# EAGLE board controller-ha-v2 (EAGLE 6.5.0), part 1 of 2
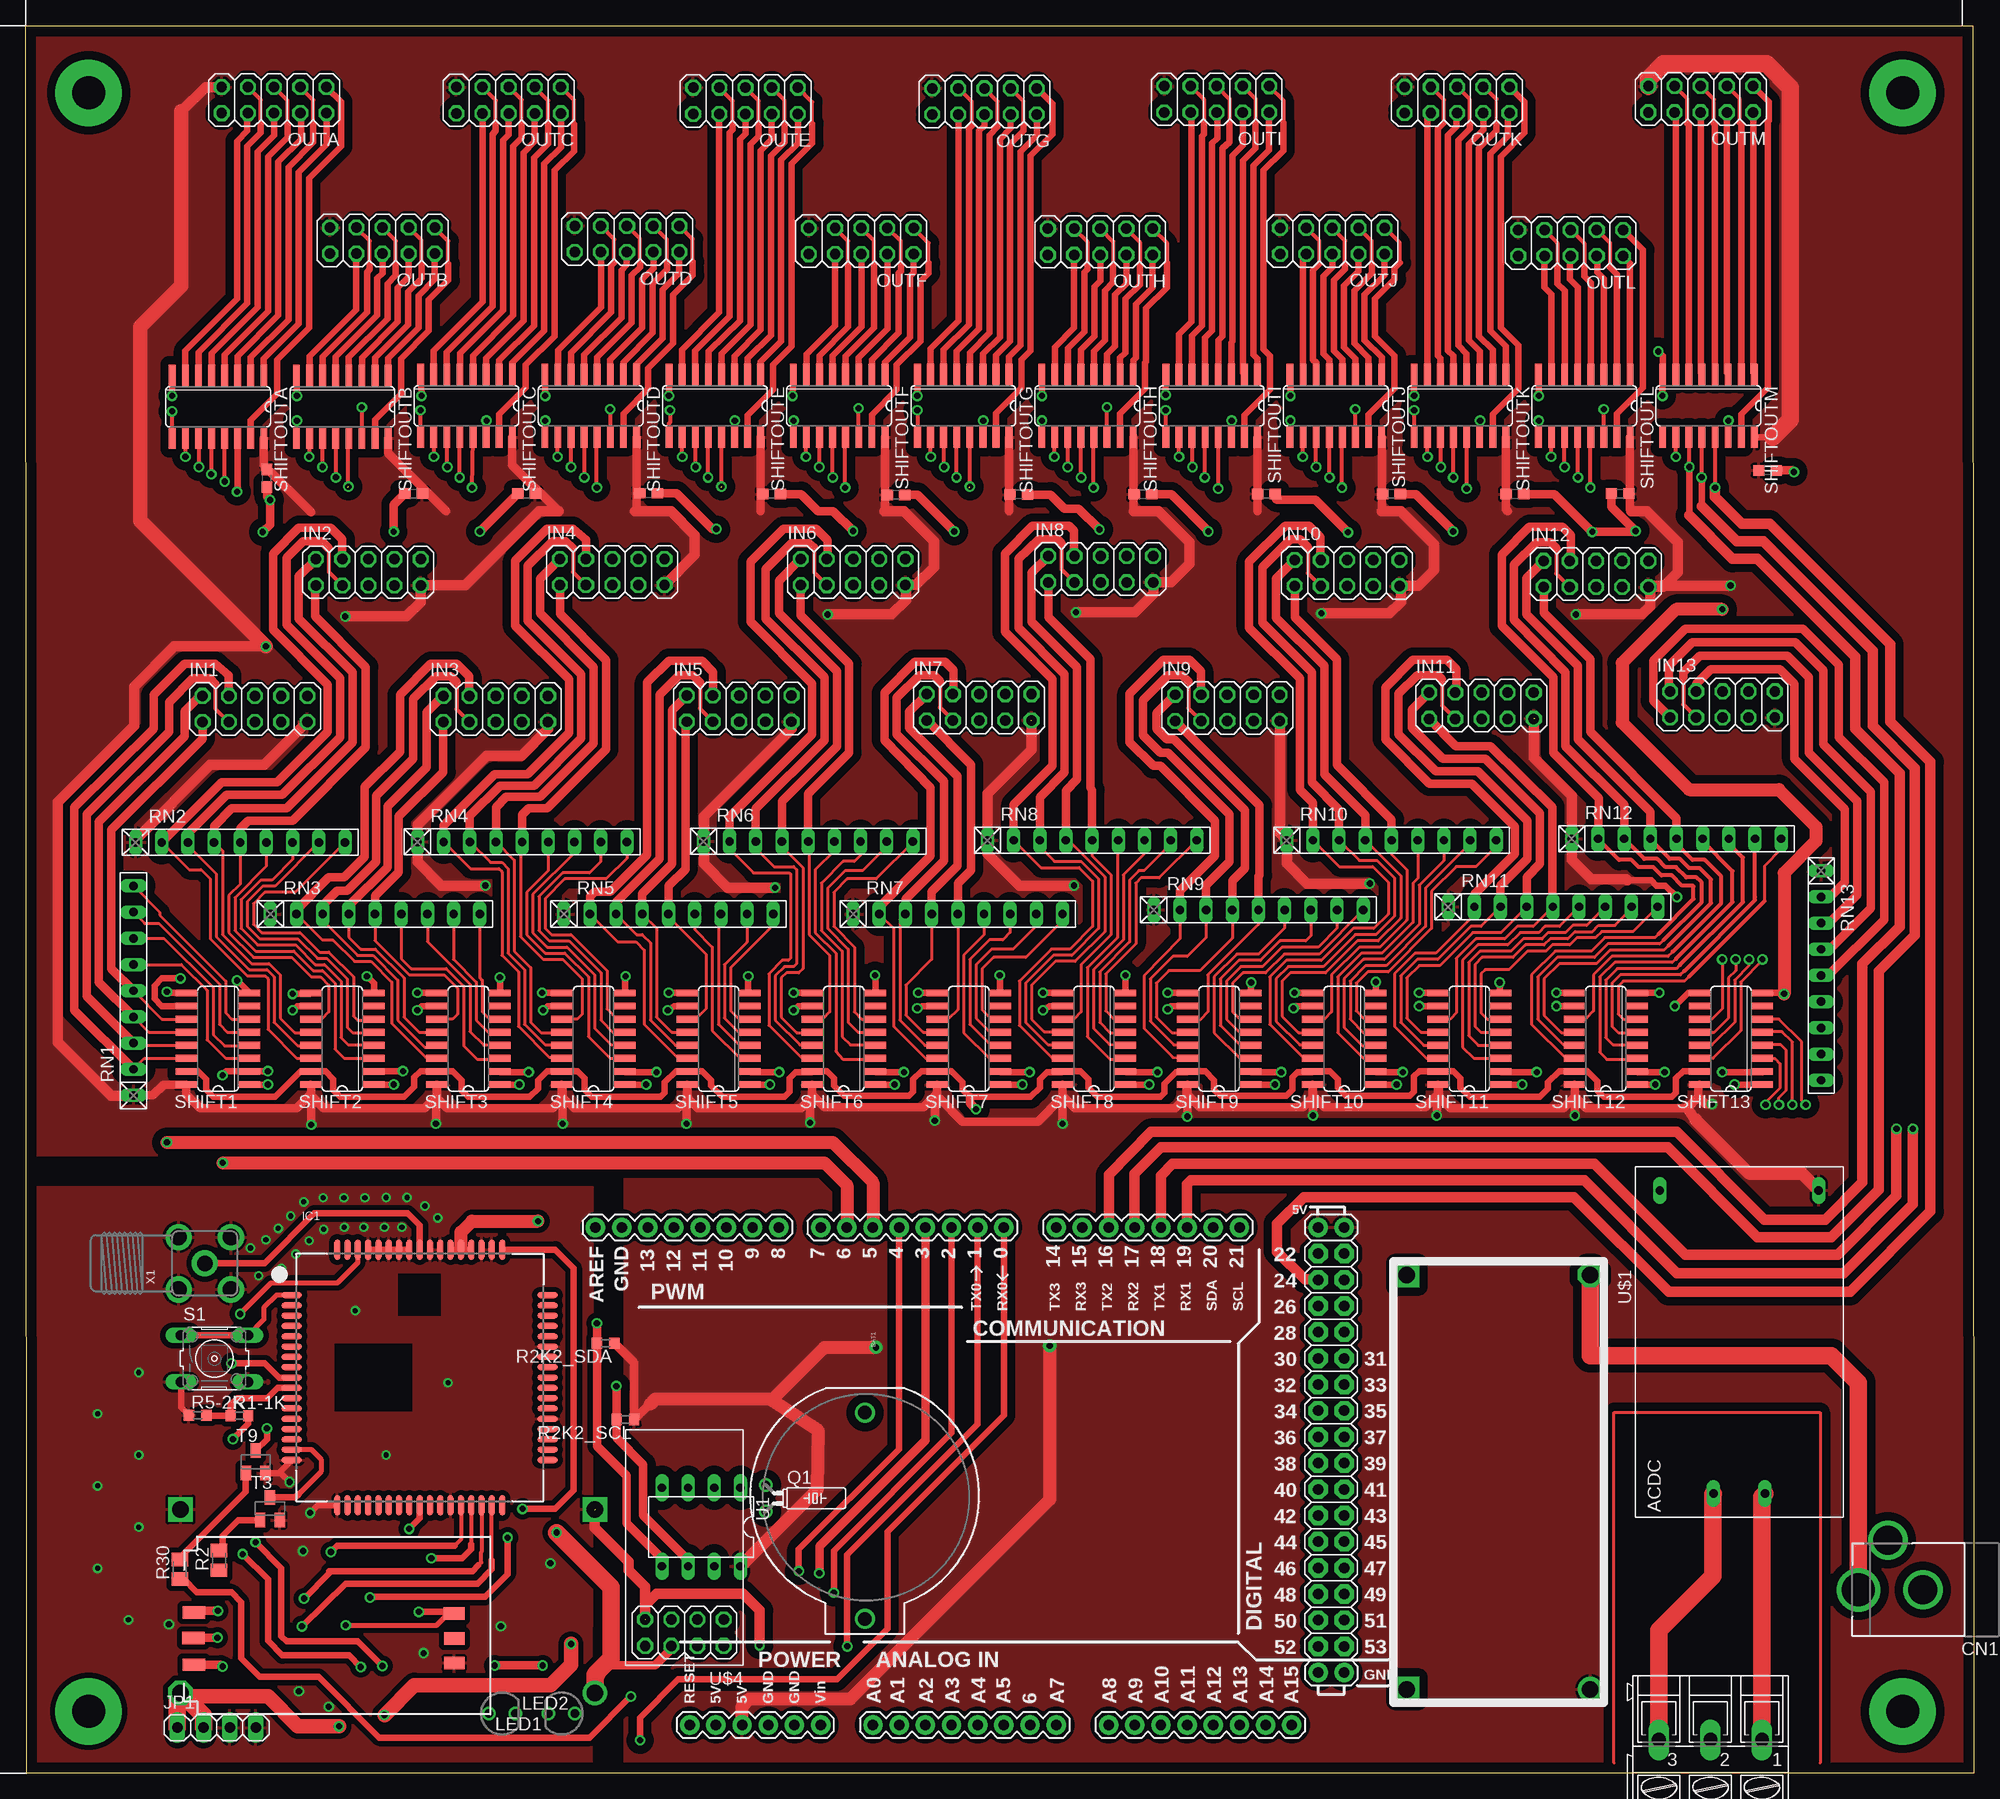
[diagram p2: board, top side]
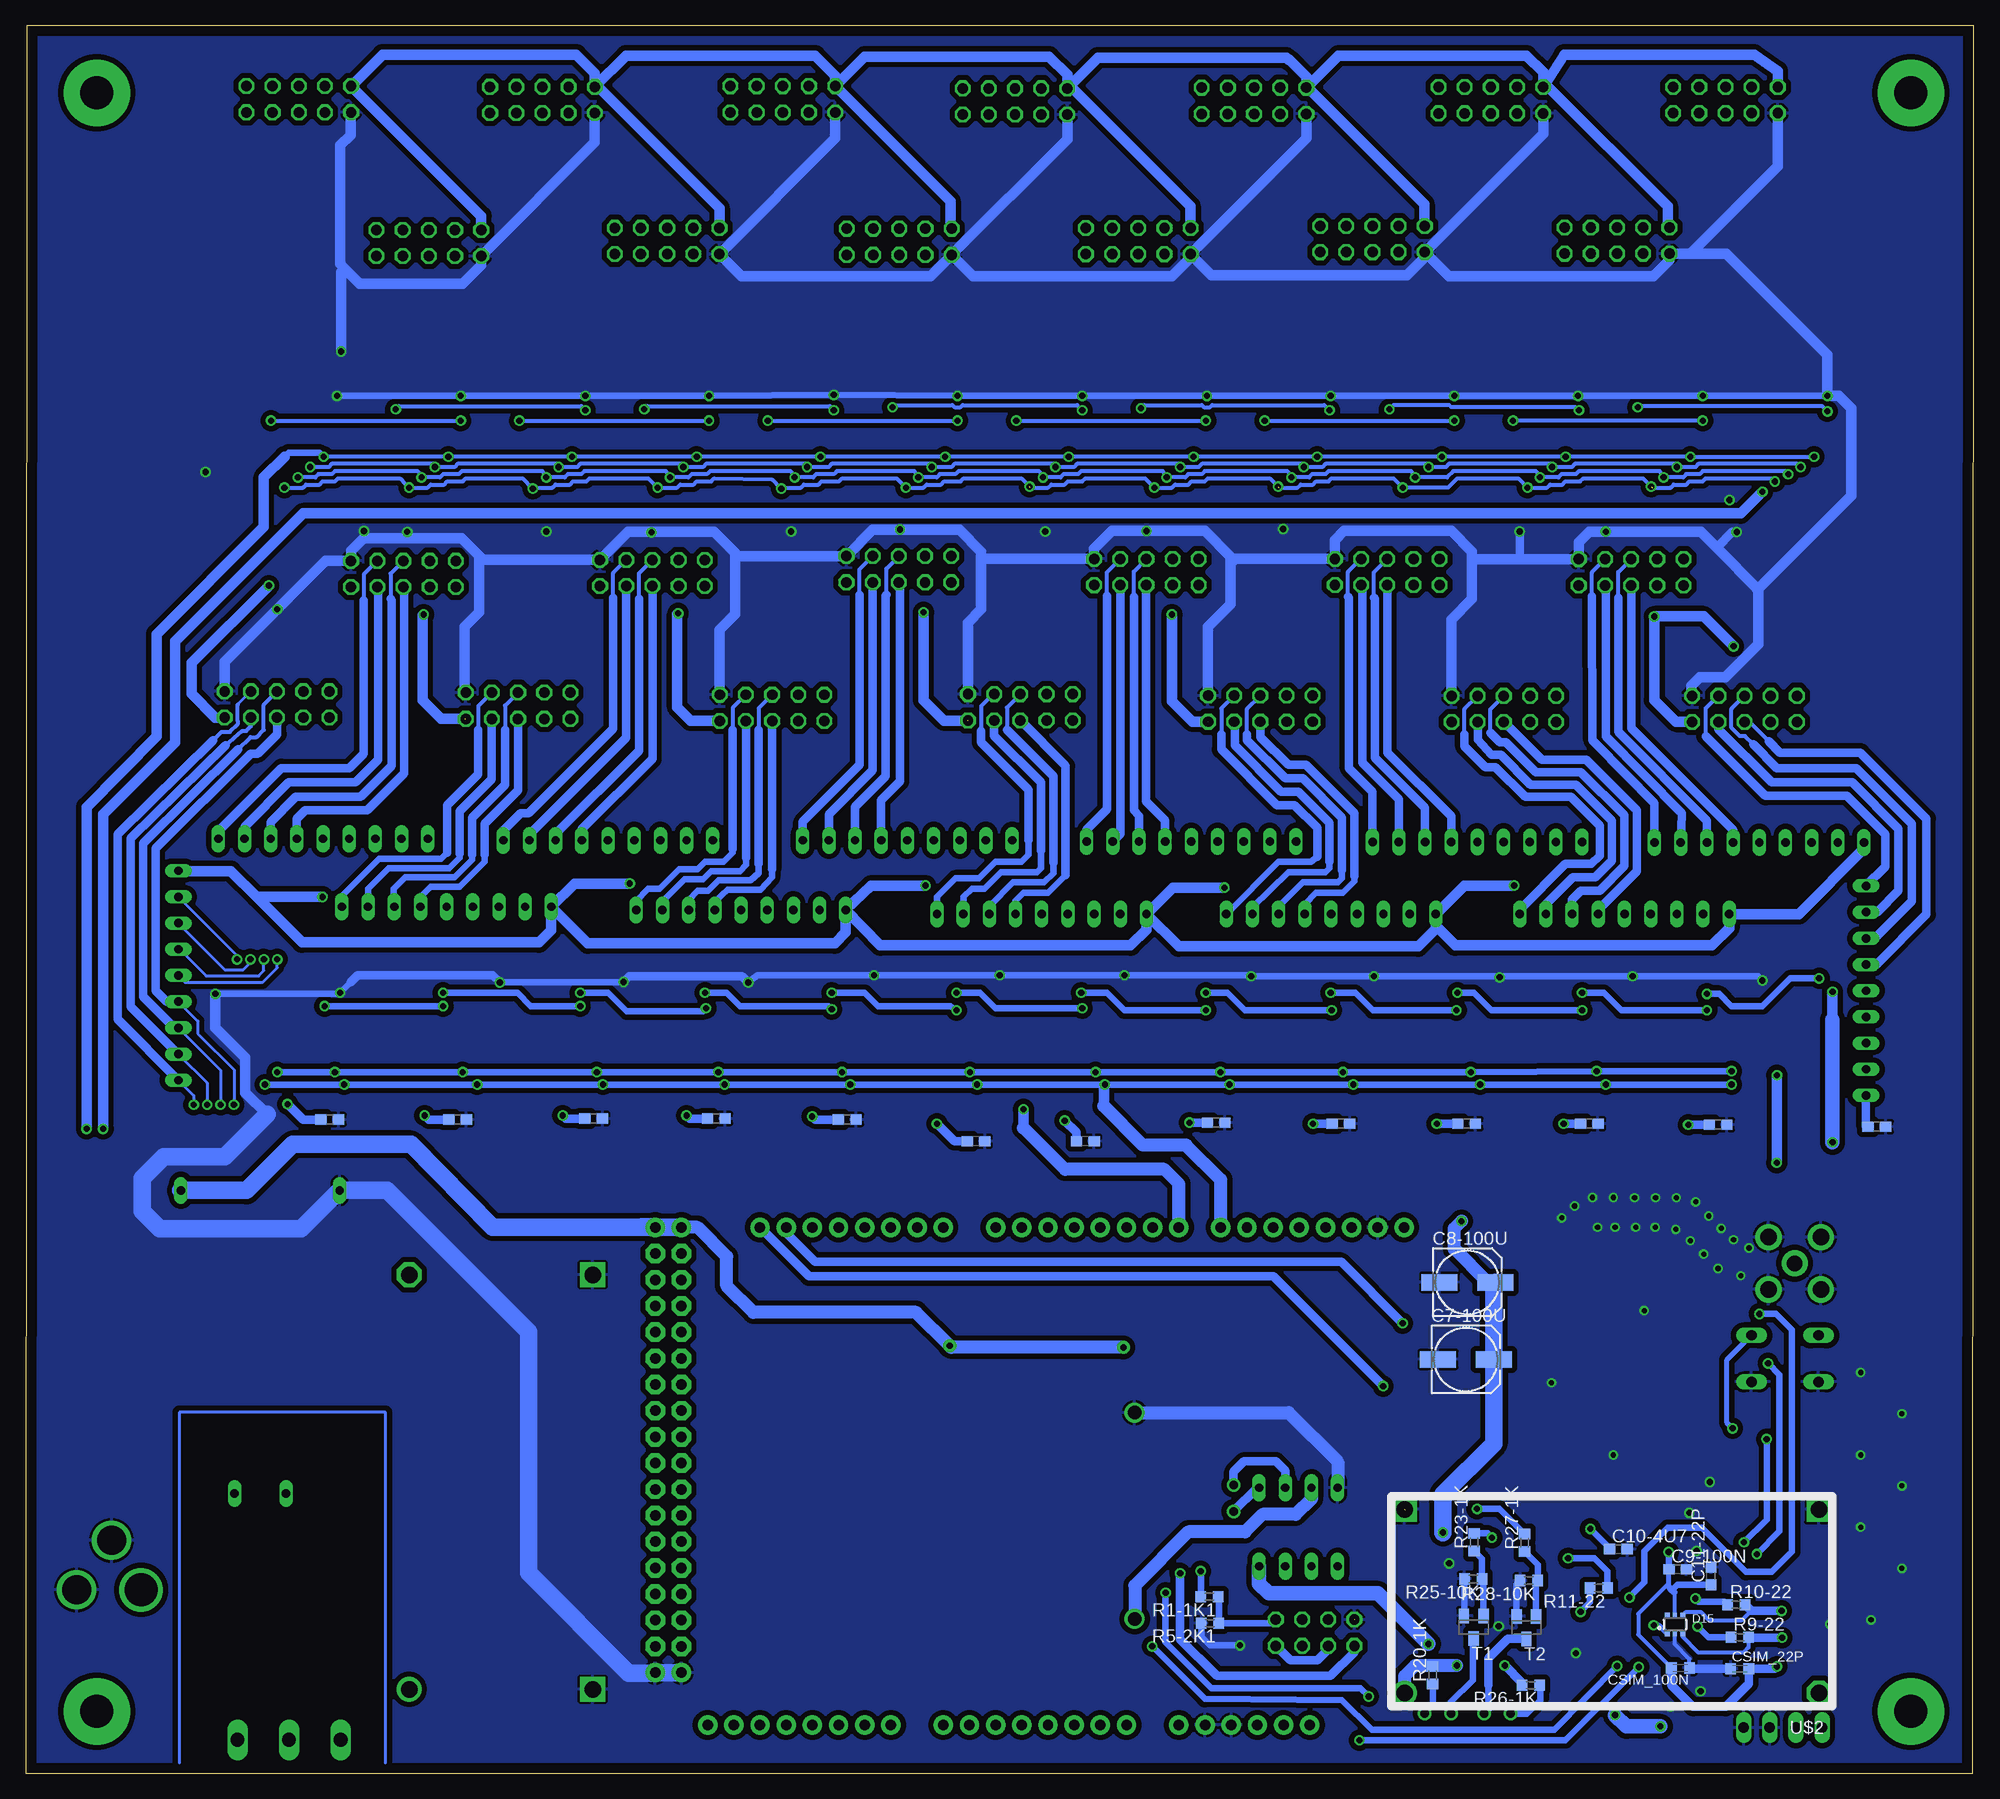
[diagram p3: board, bottom side, seen from below]

Size 189 x 169.5 mm. Coordinates in mm from the lower left corner, seen from the top.
Outline: 0.1,0 0,169.5 188.9,169.5 189,0 0.1,0
Copper layers (1*16): Top 0.035mm / dielectric 1.5mm / Bottom 0.035mm
Design rules "default": minimum track width 10mil, minimum drill 24mil, track to track 8mil, track to pad 8mil, pad to pad 8mil, via to via 8mil, smd to smd 8mil, copper to edge 40mil, drill to drill 8mil, minimum pad ring 10mil, minimum via ring 8mil, stop-mask expansion 4mil, vias tented up to drill 0mil, thermal gap 10mil
Net classes: 1 power: width 0.305 mm, drill 0.6 mm, clearance 0.813 mm; 2 GND: width 0.305 mm, drill 0.6 mm, clearance 0.508 mm; 3 LIVEAC: width 0.508 mm, drill 0.508 mm, clearance 1.27 mm

## Footprints (pad centres in the part's own frame; a part is rotated, then mirrored left to right if it is on the bottom)
AK3003 = drill 1.321 long: 1 -5.004,0; 2 0,0; 3 5.004,0
HLK-PM01 = drill 0.8 long: AC$1 -14.7,2.5; AC$2 -14.7,-2.5; GND 14.7,7.7; VOUT 14.7,-7.7
BATTCOM_20MM_PTH = drill 1.3: 1 11.85,0; 2 -8.15,0
153CLV-0605 = smd 3.5 x 1.6: + 2.7,0; - -2.7,0
C0603 = smd 1.1 x 1: 1 -0.85,0; 2 0.85,0
DCJACK_2MM_PTH = drill 2.8: GND 0,7.35; GNDBREAK 4.8,10.75 | drill 3.2: PWR 0,13.6
C0603K = smd 1.05 x 1.08: 1 -0.875,0; 2 0.875,0
SOT363 = smd 0.5 x 0.5: 1 -0.75,-0.9; 3 0.75,-0.9; 4 0.75,0.9; 6 -0.75,0.9 | smd 0.4 x 0.5: 2 0,-0.9; 5 0,0.9
SIM900_SMT = smd 2 x 0.6: P$1 -12.4,8; P$2 -12.4,7; P$3 -12.4,6; P$4 -12.4,5; P$5 -12.4,4; P$6 -12.4,3; P$7 -12.4,2; P$8 -12.4,1; P$9 -12.4,0; P$10 -12.4,-1; P$11 -12.4,-2; P$12 -12.4,-3; P$13 -12.4,-4; P$14 -12.4,-5; P$15 -12.4,-6; P$16 -12.4,-7; P$17 -12.4,-8; P$35 12.4,-8; P$36 12.4,-7; P$37 12.4,-6; P$38 12.4,-5; P$39 12.4,-4; P$40 12.4,-3; P$41 12.4,-2; P$42 12.4,-1; P$43 12.4,0; P$44 12.4,1; P$45 12.4,2; P$46 12.4,3; P$47 12.4,4; P$48 12.4,5; P$49 12.4,6; P$50 12.4,7; P$51 12.4,8 | smd 0.6 x 2: P$18 -8,-12.4; P$19 -7,-12.4; P$20 -6,-12.4; P$21 -5,-12.4; P$22 -4,-12.4; P$23 -3,-12.4; P$24 -2,-12.4; P$25 -1,-12.4; P$26 0,-12.4; P$27 1,-12.4; P$28 2,-12.4; P$29 3,-12.4; P$30 4,-12.4; P$31 5,-12.4; P$32 6,-12.4; P$33 7,-12.4; P$34 8,-12.4; P$52 8,12.4; P$53 7,12.4; P$54 6,12.4; P$55 5,12.4; P$56 4,12.4; P$57 3,12.4; P$58 2,12.4; P$59 1,12.4; P$60 0,12.4; P$61 -1,12.4; P$62 -2,12.4; P$63 -3,12.4; P$64 -4,12.4; P$65 -5,12.4; P$66 -6,12.4; P$67 -7,12.4; P$68 -8,12.4
2X05 = drill 1.016 octagon: 1 -5.08,-1.27; 2 -5.08,1.27; 3 -2.54,-1.27; 4 -2.54,1.27; 5 0,-1.27; 6 0,1.27; 7 2.54,-1.27; 8 2.54,1.27; 9 5.08,-1.27; 10 5.08,1.27
1X04 = drill 1.016 long: 1 -3.81,0; 2 -1.27,0; 3 1.27,0; 4 3.81,0
LED3MM-NS = drill 0.813: A -1.27,0; K 1.27,0
TC26H = drill 0.813: 1 -1.27,0; 2 1.27,0
R0603 = smd 1 x 1.1: 1 -0.85,0; 2 0.85,0
M0805 = smd 1.3 x 1.6: 1 -0.95,0; 2 0.95,0
RN-9 = drill 0.813 long: 1 -10.16,0; 2 -7.62,0; 3 -5.08,0; 4 -2.54,0; 5 0,0; 6 2.54,0; 7 5.08,0; 8 7.62,0; 9 10.16,0
B3F-10XX = drill 1.016 long: 1 -3.251,2.261; 2 3.251,2.261; 3 -3.251,-2.261; 4 3.251,-2.261
SO16 = smd 0.66 x 2.032: 1 -4.445,-3.073; 2 -3.175,-3.073; 3 -1.905,-3.073; 4 -0.635,-3.073; 5 0.635,-3.073; 6 1.905,-3.073; 7 3.175,-3.073; 8 4.445,-3.073; 9 4.445,3.073; 10 3.175,3.073; 11 1.905,3.073; 12 0.635,3.073; 13 -0.635,3.073; 14 -1.905,3.073; 15 -3.175,3.073; 16 -4.445,3.073
SOT23-BEC = smd 1 x 1.4: B -0.95,-1.1; C 0,1.1; E 0.95,-1.1
DIL08 = drill 0.813 long: 1 -3.81,-3.81; 2 -1.27,-3.81; 3 1.27,-3.81; 4 3.81,-3.81; 5 3.81,3.81; 6 1.27,3.81; 7 -1.27,3.81; 8 -3.81,3.81
ARDUINO_MEGA = drill 1.016 pad 1.88: 0 63.5,50.8; 1 60.96,50.8; 2 58.42,50.8; 3 55.88,50.8; 3.3V 35.56,2.54; 4 53.34,50.8; 5 50.8,50.8; 5V@0 38.1,2.54; 5V@1 93.98,50.8; 5V@2 96.52,50.8; 6 48.26,50.8; 7 45.72,50.8; 8 41.656,50.8; 9 39.116,50.8; 10 36.576,50.8; 11 34.036,50.8; 12 31.496,50.8; 13 28.956,50.8; 14 68.58,50.8; 15 71.12,50.8; 16 73.66,50.8; 17 76.2,50.8; 18 78.74,50.8; 19 81.28,50.8; 20 83.82,50.8; 21 86.36,50.8; A0 50.8,2.54; A1 53.34,2.54; A2 55.88,2.54; A3 58.42,2.54; A4 60.96,2.54; A5 63.5,2.54; A6 66.04,2.54; A7 68.58,2.54; A8 73.66,2.54; A9 76.2,2.54; A10 78.74,2.54; A11 81.28,2.54; A12 83.82,2.54; A13 86.36,2.54; A14 88.9,2.54; A15 91.44,2.54; AREF 23.876,50.8; GND@0 40.64,2.54; GND@1 43.18,2.54; GND@2 93.98,7.62; GND@3 96.52,7.62; GND@4 26.416,50.8; RESET 33.02,2.54; VIN 45.72,2.54 | drill 1.016 pad 1.88 octagon: 22 93.98,48.26; 23 96.52,48.26; 24 93.98,45.72; 25 96.52,45.72; 26 93.98,43.18; 27 96.52,43.18; 28 93.98,40.64; 29 96.52,40.64; 30 93.98,38.1; 31 96.52,38.1; 32 93.98,35.56; 33 96.52,35.56; 34 93.98,33.02; 35 96.52,33.02; 36 93.98,30.48; 37 96.52,30.48; 38 93.98,27.94; 39 96.52,27.94; 40 93.98,25.4; 41 96.52,25.4; 42 93.98,22.86; 43 96.52,22.86; 44 93.98,20.32; 45 96.52,20.32; 46 93.98,17.78; 47 96.52,17.78; 48 93.98,15.24; 49 96.52,15.24; 50 93.98,12.7; 51 96.52,12.7; 52 93.98,10.16; 53 96.52,10.16
DCDCMODULE = drill 1.6 square: GND#0 1.7,1.7; GND#1 41.9,1.7 | drill 1.6 octagon: VIN 1.7,19.5 | drill 1.6: VOUT 41.9,19.5
ESP8266 = drill 1.016 octagon: CHPD 1.27,1.27; GND 3.81,-1.27; IO0 -1.27,-1.27; IO2 1.27,-1.27; RST -1.27,1.27; RXD -3.81,-1.27; TXD 3.81,1.27; VCC -3.81,1.27
SIMHOLDER3 = smd 2.2 x 1.2: 1 0.95,4.81; 2 0.91,7.41; 3 0.95,9.86 | smd 2 x 1.2: 4 26.2,9.78; 5 26.22,7.34; 6 26.22,4.98
SMA90_DIP = drill 1.5 pad 2.54: ANTENNA 0,0 | drill 1.6 pad 2.54: GND1 -2.54,2.54; GND2 2.54,2.54; GND3 -2.54,-2.54; GND4 2.54,-2.54

## Placement (x,y rotation side)
AC_IN  AK3003  [AK3003]  163.45,3.24 180 top
ACDC  HLK-PM01  [HLK-PM01]  166.25,41.83 90 top
BAT1  [BATTCOM_20MM_PTH]  81.42,26.82 270 top
C7-100U  [153CLV-0605]  49.27,40.14 0 bottom
C8-100U  [153CLV-0605]  49.13,47.62 0 bottom
C9-100N  [C0603]  28.72,19.79 0 bottom
C9-100N1  [C0603]  9.4,62.7 180 bottom
C9-100N2  [C0603]  24.8,62.9 180 bottom
C9-100N3  [C0603]  37.3,63 180 bottom
C9-100N4  [C0603]  49.2,63 180 bottom
C9-100N5  [C0603]  61.4,63 180 bottom
C9-100N6  [C0603]  73.5,63.1 180 bottom
C9-100N7  [C0603]  86.2,61.3 180 bottom
C9-100N8  [C0603]  96.8,61.3 180 bottom
C9-100N9  [C0603]  109.3,63.4 180 bottom
C9-100N10  [C0603]  122,63.5 180 bottom
C9-100N11  [C0603]  133.9,63.5 180 bottom
C9-100N12  [C0603]  147.1,63.4 180 bottom
C9-100N13  [C0603]  159.5,63.4 180 bottom
C9-100N14  [C0603]  23.4,125.6 90 top
C9-100N15  [C0603]  37.62,124.13 0 top
C9-100N16  [C0603]  48.59,124.13 0 top
C9-100N17  [C0603]  60.42,124.15 180 top
C9-100N18  [C0603]  72.36,124.08 180 top
C9-100N19  [C0603]  84.44,124 180 top
C9-100N20  [C0603]  96.34,124.03 180 top
C9-100N21  [C0603]  108.4,124.05 180 top
C9-100N22  [C0603]  120.38,124.09 180 top
C9-100N23  [C0603]  132.49,124.08 180 top
C9-100N24  [C0603]  144.49,124.07 180 top
C9-100N25  [C0603]  154.69,124.12 0 top
C9-100N26  [C0603]  169,126.37 180 top
C10-4U7  [C0603]  34.48,21.74 0 bottom
C11-22P  [C0603]  25.48,19.13 90 bottom
CN1  [DCJACK_2MM_PTH]  191.42,17.79 90 top
CSIM_22P  [C0603K]  22.71,10.14 0 bottom
CSIM_100N  [C0603K]  28.45,10.21 180 bottom
D15  [SOT363]  28.99,14.43 0 bottom
IC1  [SIM900_SMT]  38.22,38.38 0 top
IN1  [2X05]  22.24,103.24 0 top
IN2  [2X05]  33.24,116.49 0 top
IN3  [2X05]  45.59,103.24 0 top
IN4  [2X05]  56.9,116.52 0 top
IN5  [2X05]  69.21,103.26 0 top
IN6  [2X05]  80.27,116.51 0 top
IN7  [2X05]  92.5,103.39 0 top
IN8  [2X05]  104.29,116.79 0 top
IN9  [2X05]  116.59,103.34 0 top
IN10  [2X05]  128.2,116.42 0 top
IN11  [2X05]  141.24,103.55 0 top
IN12  [2X05]  152.35,116.33 0 top
IN13  [2X05]  164.62,103.67 0 top
JP1  [1X04]  18.52,4.42 0 top
LED1  [LED3MM-NS]  51.99,5.8 180 top
LED2  [LED3MM-NS]  46.22,5.78 0 top
OUTA  [2X05]  24.09,162.29 180 top
OUTB  [2X05]  34.61,148.66 180 top
OUTC  [2X05]  46.85,162.28 180 top
OUTD  [2X05]  58.34,148.81 180 top
OUTE  [2X05]  69.83,162.22 180 top
OUTF  [2X05]  81.06,148.61 180 top
OUTG  [2X05]  93.02,162.16 180 top
OUTH  [2X05]  104.25,148.55 180 top
OUTI  [2X05]  115.55,162.37 180 top
OUTJ  [2X05]  126.77,148.63 180 top
OUTK  [2X05]  138.87,162.31 180 top
OUTL  [2X05]  149.89,148.43 180 top
OUTM  [2X05]  162.51,162.38 180 top
Q1  [TC26H]  71.81,26.67 270 top
R1-1K  [R0603]  20.73,34.68 0 top
R1-1K1  [R0603]  74.15,17.11 180 bottom
R2  R120  [M0805]  18.76,20.64 90 top
R2K2_SCL  [R0603]  58.17,34.31 180 top
R2K2_SDA  [R0603]  56.26,41.71 180 top
R5-2K  [R0603]  16.68,34.72 0 top
R5-2K1  [R0603]  74.1,14.54 0 bottom
R9-22  [R0603]  22.69,13.19 0 bottom
R10-22  [R0603]  23.03,16.34 0 bottom
R11-22  [R0603]  36.38,17.96 180 bottom
R20-1K  [R0603]  52.49,9.5 90 bottom
R23-1K  [R0603]  48.47,22.41 90 bottom
R25-10K  [R0603]  48.56,18.84 180 bottom
R26-1K  [R0603]  42.97,8.53 180 bottom
R27-1K  [R0603]  43.56,22.34 90 bottom
R28-10K  [R0603]  43.16,18.68 180 bottom
R30  R120  [M0805]  14.95,19.79 90 top
RN1  [RN-9]  10.45,75.9 90 top
RN2  [RN-9]  20.81,90.29 0 top
RN3  [RN-9]  33.89,83.34 0 top
RN4  [RN-9]  48.16,90.34 0 top
RN5  [RN-9]  62.36,83.34 0 top
RN6  [RN-9]  75.91,90.39 0 top
RN7  [RN-9]  90.43,83.34 0 top
RN8  [RN-9]  103.46,90.49 0 top
RN9  [RN-9]  119.6,83.74 0 top
RN10  [RN-9]  132.51,90.49 0 top
RN11  [RN-9]  148.17,84.04 0 top
RN12  [RN-9]  160.16,90.64 0 top
RN13  [RN-9]  174.2,77.38 270 top
S1  [B3F-10XX]  18.31,40.22 0 top
SHIFT1  74HC165D  [SO16]  18.66,71.24 90 top
SHIFT2  74HC165D  [SO16]  30.71,71.24 90 top
SHIFT3  74HC165D  [SO16]  42.94,71.24 90 top
SHIFT4  74HC165D  [SO16]  55.08,71.24 90 top
SHIFT5  74HC165D  [SO16]  67.22,71.24 90 top
SHIFT6  74HC165D  [SO16]  79.36,71.24 90 top
SHIFT7  74HC165D  [SO16]  91.5,71.24 90 top
SHIFT8  74HC165D  [SO16]  103.64,71.24 90 top
SHIFT9  74HC165D  [SO16]  115.78,71.24 90 top
SHIFT10  74HC165D  [SO16]  127.92,71.24 90 top
SHIFT11  74HC165D  [SO16]  140.06,71.24 90 top
SHIFT12  74HC165D  [SO16]  153.3,71.24 90 top
SHIFT13  74HC165D  [SO16]  165.44,71.24 90 top
SHIFTOUTA  74HC595D  [SO16]  18.66,132.54 180 top
SHIFTOUTB  74HC595D  [SO16]  30.71,132.54 180 top
SHIFTOUTC  74HC595D  [SO16]  42.76,132.64 180 top
SHIFTOUTD  74HC595D  [SO16]  54.81,132.64 180 top
SHIFTOUTE  74HC595D  [SO16]  66.86,132.64 180 top
SHIFTOUTF  74HC595D  [SO16]  78.91,132.64 180 top
SHIFTOUTG  74HC595D  [SO16]  90.96,132.64 180 top
SHIFTOUTH  74HC595D  [SO16]  103.01,132.64 180 top
SHIFTOUTI  74HC595D  [SO16]  115.06,132.64 180 top
SHIFTOUTJ  74HC595D  [SO16]  127.11,132.64 180 top
SHIFTOUTK  74HC595D  [SO16]  139.16,132.64 180 top
SHIFTOUTL  74HC595D  [SO16]  151.21,132.64 180 top
SHIFTOUTM  74HC595D  [SO16]  163.26,132.64 180 top
T1  [SOT23-BEC]  48.51,14.16 180 bottom
T2  [SOT23-BEC]  43.41,14.12 180 bottom
T3  [SOT23-BEC]  23.7,25.66 0 top
T9  [SOT23-BEC]  22.3,30.21 0 top
U1  DS1307  [DIL08]  65.53,23.88 180 top
U3  ARDUINO-MEGAFULL  [ARDUINO_MEGA]  31.4,2.14 0 top
U$1  DCDCMODULE  [DCDCMODULE]  132.3,50.04 270 top
U$2  DCDCMODULE  [DCDCMODULE]  13.32,27.28 180 bottom
U$4  ESP8266  [ESP8266]  63.9,13.63 180 top
U$5  SIMHOLDER3  [SIMHOLDER3]  15.36,5.71 0 top
X1  [SMA90_DIP]  17.37,49.46 90 top

## Tracks (layer width: path | path; a pad name or v marks a point on that pad's centre or on a via)
1-1
  Top 0.305: RN1.5 13.21,73.14 SHIFT1.11
  Top 0.813: RN1.5 8.3,78.05 8.3,91.5 17.16,100.36 IN1.1
1-2
  Top 0.305: RN1.4 11.94,71.88 SHIFT1.12
  Top 0.813: RN1.4 7.1,76.71 7.1,92.3 15.4,100.6 15.4,103 16.91,104.51 IN1.2
1-3
  Top 0.305: RN1.3 10.66,70.61 SHIFT1.13
  Top 0.406: 18.4,105.7 18.4,103.27 IN1.3
  Top 0.813: RN1.3 5.9,75.37 5.9,93 13.9,101 13.9,103.9 16.2,106.2 17.9,106.2 18.4,105.7
1-4
  Top 0.305: RN1.2 11.5,69.33 SHIFT1.14
  Top 0.813: RN1.2 4.7,74.03 4.7,93.7 12.4,101.3 12.4,104.6 15.4,107.6 18.4,107.6 19.7,106.5 IN1.4
1-5
  Top 0.305: RN1.6 15.1,78.44 17.6,75.94 17.6,71.14 19.4,69.34 SHIFT1.3
  Bottom 0.406: 19.9,100.1 21.77,101.97 IN1.5
  Bottom 0.813: RN1.6 9.46,78.44 4.6,83.3 4.6,92.6 11,99 18.8,99 19.9,100.1
1-6
  Top 0.305: RN1.7 13.38,80.98 18.2,76.26 18.2,71.64 19.3,70.54 21.67,70.54 SHIFT1.4
  Bottom 0.406: 21.4,99.8 22.2,100.6 22.7,100.6 23.5,101.4 23.5,103.25 IN1.6
  Bottom 0.813: RN1.7 9.62,80.98 6,84.6 6,92.1 11.4,97.5 19.1,97.5 21.4,99.8
1-7
  Top 0.305: RN1.8 11.52,82.44 12.9,82.44 18.8,76.54 18.8,72.64 19.57,71.88 SHIFT1.5
  Bottom 0.813: RN1.8 9.38,83.52 7.3,85.6 7.3,91.6 11.8,96.1 19.6,96.1 24.78,101.28 IN1.7
1-8
  Top 0.305: RN1.9 13,83.51 13,83.24 19.4,76.84 19.4,73.74 20,73.14 SHIFT1.6
  Bottom 0.406: 26,100.6 26,103.29 IN1.8
  Bottom 0.813: RN1.9 8.6,87.91 8.6,91.1 12.3,94.8 20.2,94.8 26,100.6
2-1
  Top 0.305: RN2.5 20.81,86.25 19.7,85.14 19.7,81.54 22.1,79.14 25.8,79.14 27.7,77.24 28.6,77.24 29.4,76.44 29.4,73.84 28.7,73.14 SHIFT2.11
  Top 0.813: RN2.5 20.81,91.61 21.6,92.4 25.9,92.4 33,99.5 33,107.3 28.1,112.2 28.1,115.16 IN2.1
2-2
  Top 0.305: RN2.4 19.1,89.46 19.1,81.34 21.9,78.54 23.6,78.54 24.7,77.44 24.7,73.24 26.1,71.84 27.6,71.84 SHIFT2.12
  Top 0.813: RN2.4 18.27,91.87 20,93.6 25.3,93.6 31.7,100 31.7,106.8 26.5,112 26.5,116.1 IN2.2
2-3
  Top 0.305: RN2.3 15.73,90.01 18.5,87.24 18.5,81.14 21.7,77.94 23.4,77.94 24.1,77.24 24.1,72.84 26.4,70.54 28.2,70.54 28.3,70.44 27.8,70.44 SHIFT2.13
  Top 0.406: 29.4,118.8 29.4,116.52 IN2.3
  Top 0.813: RN2.3 15.73,91.13 19.5,94.9 24.9,94.9 30.5,100.5 30.5,106.2 25.3,111.4 25.3,117.9 26.9,119.5 28.7,119.5 29.4,118.8
2-4
  Top 0.305: RN2.2 15.84,87.64 17,87.64 17.9,86.74 17.9,80.94 21.5,77.34 23.2,77.34 23.5,77.04 23.5,72.14 26.3,69.34 SHIFT2.14
  Top 0.813: RN2.2 19,96.1 24.4,96.1 29.3,101 29.3,105.6 24,110.9 24,118.3 26.5,120.8 29.6,120.8 30.7,119.7 IN2.4
2-5
  Top 0.305: RN2.6 23.35,87.99 20.3,84.94 20.3,81.74 22.3,79.74 26,79.74 27.9,77.84 28.8,77.84 30,76.64 30,70.24 30.9,69.34 SHIFT2.3
  Bottom 0.813: RN2.6 23.35,91.45 33.24,101.34 IN2.5
2-6
  Top 0.305: RN2.7 25.89,88.63 23.9,86.64 22.8,86.64 20.9,84.74 20.9,81.94 22.5,80.34 26.2,80.34 28.1,78.44 29,78.44 30.6,76.84 30.6,71.34 31.3,70.64 33.75,70.64 SHIFT2.4
  Bottom 0.406: 34.5,114 34.5,116.5 IN2.6
  Bottom 0.813: RN2.7 25.89,92.39 34.5,101 34.5,114
2-7
  Top 0.305: RN2.8 24.18,86.04 23,86.04 21.5,84.54 21.5,82.14 22.7,80.94 26.4,80.94 28.3,79.04 29.2,79.04 31.2,77.04 31.2,72.34 31.7,71.84 33.75,71.84 SHIFT2.5
  Bottom 0.813: RN2.8 28.33,93.13 35.7,100.6 35.7,115.14 IN2.7 35.8,115.1
2-8
  Top 0.305: RN2.9 26.12,85.44 23.2,85.44 22.1,84.34 22.1,82.34 22.9,81.54 26.6,81.54 28.5,79.64 29.4,79.64 31.8,77.24 31.8,73.44 32.2,73.04 33.68,73.04 SHIFT2.6
  Bottom 0.406: 37.05,114.15 37.05,116.49 IN2.8
  Bottom 0.813: RN2.9 30.97,94.07 36.7,99.9 37,100.2 37.05,114.15
3-1
  Top 0.305: RN3.5 33.89,80.75 37.2,77.44 40.6,77.44 41.9,76.14 41.9,73.64 41.4,73.14 SHIFT3.11
  Top 0.813: RN3.5 33.89,85.09 36.2,87.4 36.2,92.8 40.5,97.1 IN3.1
3-2
  Top 0.305: RN3.4 31.35,81.09 32.5,79.94 33.9,79.94 36.7,77.14 36.7,73.34 38.16,71.88 SHIFT3.12
  Top 0.813: RN3.4 31.35,84.15 35.1,87.9 35.1,93.8 38.9,97.6 38.9,102.9 IN3.2
3-3
  Top 0.305: RN3.3 28.81,82.73 32.2,79.34 33.7,79.34 36.1,76.94 36.1,73.04 38.7,70.44 39.7,70.44 SHIFT3.13
  Top 0.406: 41.8,105.8 41.8,103.22 IN3.3
  Top 0.813: RN3.3 28.94,83.34 28.94,84.34 30.2,85.6 31.2,85.6 34,88.4 34,94.8 37.6,98.4 37.6,104.2 39.8,106.4 41.2,106.4 41.8,105.8
3-4
  Top 0.305: RN3.2 28.77,80.84 29.8,80.84 31.9,78.74 33.5,78.74 35.5,76.74 35.5,72.74 39,69.24 39.77,69.24 SHIFT3.14
  Top 0.813: RN3.2 26.27,83.77 29.4,86.9 30.9,86.9 32.9,88.9 32.9,95.7 36.3,99.1 36.3,104.6 39.3,107.6 41.8,107.6 43,106.4 43,104.56 IN3.4
3-5
  Top 0.305: RN3.6 36.43,79.01 37.4,78.04 40.8,78.04 42.5,76.34 42.5,70.54 43.8,69.24 45.92,69.24 SHIFT3.3
  Bottom 0.813: IN3.5 41.92,98.3 37.6,98.3 32.7,93.4 32.7,87.5 36.43,83.77 RN3.6
3-6
  Top 0.305: RN3.7 38.97,80.67 43.1,76.54 43.1,71.94 44.4,70.64 45.98,70.64 SHIFT3.4
  Bottom 0.406: 46.9,100.9 46.9,103.2 IN3.6
  Bottom 0.813: RN3.7 38.97,84.73 38.1,85.6 36.3,85.6 33.9,88 33.9,92.9 38.1,97.1 42.5,97.1 45.4,100 46,100 46.9,100.9
3-7
  Top 0.305: RN3.8 41.51,78.93 43.7,76.74 43.7,73.04 44.9,71.84 45.98,71.84 SHIFT3.5
  Bottom 0.813: RN3.8 41.51,84.29 38.9,86.9 36.7,86.9 35.1,88.5 35.1,92.4 38.6,95.9 43,95.9 45.9,98.8 46.8,98.8 48.13,100.23 IN3.7
3-8
  Top 0.305: RN3.9 44.05,77.19 44.3,76.94 44.3,73.84 45,73.14 SHIFT3.6
  Bottom 0.406: 49.4,100.8 49.4,103.24 IN3.8
  Bottom 0.813: RN3.9 44.05,83.75 39.6,88.2 37.1,88.2 36.3,89 36.3,91.9 39.1,94.7 43.5,94.7 46.4,97.6 47.4,97.6 49.4,99.6 49.4,100.8
4-1
  Top 0.305: RN4.5 48,90.18 48,81.14 50.2,78.94 52.1,78.94 54,77.04 54,73.64 53.5,73.14 SHIFT4.11
  Top 0.813: RN4.5 48.16,92.96 48.8,93.6 50.6,93.6 56.3,99.3 56.3,107.97 51.82,112.45 IN4.1
4-2
  Top 0.305: RN4.4 47.4,88.56 47.4,79.74 49,78.14 49,72.84 50,71.84 51.97,71.84 SHIFT4.12
  Top 0.813: RN4.4 45.62,93.72 46.6,94.7 49.9,94.7 55.1,99.9 55.1,107.3 49.9,112.5 49.9,115.87 IN4.2
4-3
  Top 0.305: RN4.3 45.08,88.34 46.2,88.34 46.8,87.74 46.8,79.54 48.4,77.94 48.4,72.64 50.4,70.64 51.97,70.64 SHIFT4.13
  Top 0.406: 53.1,118.8 53.1,116.51 IN4.3
  Top 0.813: RN4.3 43.08,92.88 46,95.8 49.3,95.8 53.9,100.4 53.9,106.6 48.7,111.8 48.7,117.1 51.1,119.5 52.4,119.5 53.1,118.8
4-4
  Top 0.305: RN4.2 43.14,87.74 45.9,87.74 46.2,87.44 46.2,79.34 47.8,77.74 47.8,72.44 50.8,69.44 51.9,69.44 SHIFT4.14
  Top 0.813: RN4.2 40.54,91.94 45.5,96.9 48.7,96.9 52.7,100.9 52.7,106.1 47.5,111.3 47.5,117.6 50.6,120.7 53.1,120.7 54.36,119.64 IN4.4
4-5
  Top 0.305: RN4.6 50.7,87.54 48.6,85.44 48.6,81.34 50.4,79.54 52.3,79.54 54.6,77.24 54.6,71.44 56.7,69.34 SHIFT4.3
  Bottom 0.813: RN4.6 50.7,92.8 56.9,99 IN4.5
4-6
  Top 0.305: RN4.7 53.24,89.28 49.2,85.24 49.2,81.54 50.6,80.14 52.5,80.14 55.2,77.44 55.2,72.24 56.8,70.64 58.12,70.64 SHIFT4.4
  Bottom 0.406: 58.2,114 58.2,116.49 IN4.6
  Bottom 0.813: RN4.7 53.24,93.64 58.1,98.5 58.1,113.9 58.2,114
4-7
  Top 0.305: RN4.8 55.78,88.42 54.7,87.34 52.1,87.34 49.8,85.04 49.8,81.74 50.8,80.74 52.7,80.74 55.8,77.64 55.8,73.04 57,71.84 58.12,71.84 SHIFT4.5
  Bottom 0.813: RN4.8 55.78,94.48 59.3,98 59.3,115.11 IN4.7
4-8
  Top 0.305: RN4.9 58.32,88.76 56.3,86.74 52.3,86.74 50.4,84.84 50.4,81.94 51,81.34 52.9,81.34 56.4,77.84 56.4,74.14 57.4,73.14 SHIFT4.6
  Bottom 0.406: 60.7,114.1 60.7,116.53 IN4.8
  Bottom 0.813: RN4.9 58.32,95.22 60.6,97.5 60.6,114 60.7,114.1
5-1
  Top 0.305: RN5.5 62.36,83.08 66,79.44 66,74.14 65,73.14 SHIFT5.11
  Top 0.813: RN5.5 62.36,86.06 64,87.7 64,101.86 IN5.1
5-2
  Top 0.305: RN5.4 61.2,81.96 61.2,73.34 62.66,71.88 SHIFT5.12
  Top 0.813: RN5.4 59.82,85.32 62.7,88.2 62.7,103.1 IN5.2
5-3
  Top 0.305: RN5.3 59.28,81.34 59.8,81.34 60.6,80.54 60.6,73.04 63.04,70.61 SHIFT5.13
  Top 0.406: 65.4,105.8 65.4,103.26 IN5.3
  Top 0.813: RN5.3 57.28,84.48 61.5,88.7 61.5,104.6 63.4,106.5 64.7,106.5 65.4,105.8
5-4
  Top 0.305: RN5.2 57.44,80.64 59.2,80.64 60,79.84 60,72.64 63.3,69.33 SHIFT5.14
  Top 0.813: RN5.2 54.74,85.04 55.2,85.5 56.7,85.5 60.3,89.1 60.3,105.8 62.4,107.9 65.6,107.9 66.7,106.8 66.7,104.56 IN5.4
5-5
  Top 0.305: RN5.6 64.9,81.84 66.6,80.14 66.6,72.04 69.3,69.34 SHIFT5.3
  Bottom 0.61: 60.1,87 60.1,86.5 61.2,85.4 63.8,85.4 64.9,84.3 RN5.6
  Bottom 0.813: 60.1,87 60.1,93.1 64.8,97.8 66.5,97.8 69.2,100.5 IN5.5
5-6
  Top 0.305: RN5.7 67.2,83.1 67.2,72.64 69.3,70.54 70.23,70.54 SHIFT5.4
  Bottom 0.406: 70.5,100.8 70.5,103.24 IN5.6
  Bottom 0.61: 61.3,87.6 61.3,86.8 61.7,86.4 65.1,86.4 67.4,84.1 67.4,83.38 RN5.7
  Bottom 0.813: 61.3,87.6 61.3,92.7 65.1,96.5 66.8,96.5 70.5,100.2 70.5,100.8
5-7
  Top 0.305: RN5.8 69.98,80.62 67.8,78.44 67.8,73.24 69.2,71.84 70.26,71.84 SHIFT5.5
  Bottom 0.61: 62.5,88.4 62.5,87.8 62.9,87.4 66.5,87.4 70,84 70,83.42 RN5.8
  Bottom 0.813: 62.5,88.4 62.5,92.2 65.5,95.2 67.2,95.2 71.7,99.7 71.7,101.94 IN5.7
5-8
  Top 0.305: RN5.9 72.52,82.26 68.4,78.14 68.4,73.94 69.2,73.14 SHIFT5.6
  Bottom 0.406: IN5.8 73,103.28 73,100.8
  Bottom 0.61: 63.7,88.9 64.3,88.4 67.46,88.4 RN5.9
  Bottom 0.813: 73,100.8 73,99.3 67.6,93.9 65.9,93.9 63.7,91.7 63.7,88.9
6-1
  Top 0.305: RN6.5 76,90.3 76,81.34 78,79.34 78,73.84 77.3,73.14 SHIFT6.11
  Top 0.813: RN6.5 75.91,95.01 79.9,99 79.9,107.6 75.19,112.31 IN6.1
6-2
  Top 0.305: RN6.4 73.37,89.87 75.4,87.84 75.4,78.04 75,77.64 73.8,77.64 73.3,77.14 73.3,73.34 74.8,71.84 76.25,71.84 SHIFT6.12
  Top 0.813: RN6.4 73.37,94.27 78.7,99.6 78.7,106.9 73.1,112.5 73.1,115.69 IN6.2
6-3
  Top 0.305: RN6.3 70.83,89.71 72.6,87.94 74.5,87.94 74.8,87.64 74.8,78.54 74.5,78.24 73.6,78.24 72.7,77.34 72.7,73.04 75.1,70.64 76.25,70.64 SHIFT6.13
  Top 0.406: 76.5,118.9 76.5,116.47 IN6.3
  Top 0.813: RN6.3 70.83,93.53 77.5,100.2 77.5,106.3 71.8,112 71.8,116.8 74.3,119.3 76,119.3 76.5,118.9
6-4
  Top 0.305: RN6.2 68.29,89.65 70.6,87.34 74.1,87.34 74.2,87.24 74.2,79.04 74,78.84 73.4,78.84 72.1,77.54 72.1,72.54 75.4,69.24 76.19,69.24 SHIFT6.14
  Top 0.813: RN6.2 68.29,92.79 76.3,100.8 76.3,105.7 70.3,111.7 70.3,117.5 73.5,120.7 76.7,120.7 77.8,119.6 77.8,117.85 IN6.4
6-5
  Top 0.305: RN6.6 78.45,89.49 76.6,87.64 76.6,81.54 78.6,79.54 78.6,70.04 79.3,69.24 82.34,69.24 SHIFT6.3
  Bottom 0.813: RN6.6 78.45,92.45 80.3,94.3 80.3,115.27 IN6.5
6-6
  Top 0.305: RN6.7 80.99,89.03 80.4,88.44 79.3,88.44 77.2,86.34 77.2,81.74 79.2,79.74 79.2,71.44 80,70.64 82.4,70.64 SHIFT6.4
  Bottom 0.406: 81.5,114.1 81.5,116.55 IN6.6
  Bottom 0.813: RN6.7 80.99,92.89 81.5,93.4 81.5,114.1
6-7
  Top 0.305: RN6.8 83.53,89.87 81.2,87.54 79.5,87.54 77.8,85.84 77.8,81.94 79.8,79.94 79.8,72.84 80.77,71.88 SHIFT6.5
  Bottom 0.813: RN6.8 82.81,91.11 IN6.7
6-8
  Top 0.305: RN6.9 86.07,90.31 82.5,86.74 79.7,86.74 78.4,85.44 78.4,82.14 80.4,80.14 80.4,73.84 81.09,73.14 SHIFT6.6
  Bottom 0.406: 84.1,114.2 84.1,116.49 IN6.8
  Bottom 0.813: RN6.9 86.07,91.53 84.1,93.5 84.1,114.2
7-1
  Top 0.305: RN7.5 90.43,74.07 89.5,73.14 SHIFT7.11
  Top 0.813: RN7.5 90.43,86.33 91.7,87.6 91.7,97.84 IN7.1
7-2
  Top 0.305: RN7.4 87.89,78.93 85.4,76.44 85.4,73.54 87.06,71.88 SHIFT7.12
  Top 0.813: RN7.4 87.89,85.49 90.4,88 90.4,96.7 85.7,101.4 85.7,102.94 IN7.2
7-3
  Top 0.305: RN7.3 84.8,82.79 84.8,73.04 87.23,70.61 SHIFT7.13
  Top 0.406: 88.7,105.9 88.7,103.38 IN7.3
  Top 0.813: RN7.3 85.35,84.75 89.1,88.5 89.1,96.2 84.5,100.8 84.5,104.3 86.7,106.5 88.1,106.5 88.7,105.9
7-4
  Top 0.305: RN7.2 84.2,81.95 84.2,72.44 87.3,69.34 SHIFT7.14
  Top 0.813: RN7.2 82.81,84.01 87.8,89 87.8,95.6 83.3,100.2 83.3,104.8 86.3,107.8 89.2,107.8 90,107 90,104.7 IN7.4
7-5
  Top 0.305: RN7.6 92.97,81.31 91,79.34 91,71.84 93.5,69.34 SHIFT7.3
  Bottom 0.61: 88.1,87.1 89.8,85.4 92.2,85.4 92.97,84.63 RN7.6
  Bottom 0.813: 88.1,87.1 88.1,97.72 IN7.5
7-6
  Top 0.305: RN7.7 95.51,81.55 94.8,80.84 93.5,80.84 91.6,78.94 91.6,72.64 93.6,70.64 94.54,70.64 SHIFT7.4
  Bottom 0.406: IN7.6 93.8,103.36 93.8,101.2
  Bottom 0.61: 89.3,88.3 89.3,87.3 90.2,86.4 93.2,86.4 95.5,84.1 RN7.7
  Bottom 0.813: 93.8,101.2 89.3,96.7 89.3,88.3
7-7
  Top 0.305: RN7.8 98.05,82.19 95.8,79.94 93.7,79.94 92.2,78.44 92.2,73.24 93.5,71.94 94.51,71.94 SHIFT7.5
  Bottom 0.61: 90.5,89.5 90.5,87.8 90.9,87.4 94.4,87.4 96,85.8 97.2,85.8 98,85 98,83.39 RN7.8
  Bottom 0.813: IN7.7 95.04,100.64 90.5,96.1 90.5,89.5
7-8
  Top 0.305: SHIFT7.6 93.69,73.14 92.8,74.04 92.8,78.04 93.9,79.14 97.04,79.14 100.6,82.7 RN7.9
  Bottom 0.406: IN7.8 95.2,104.6 96.3,103.5 96.3,101.1
  Bottom 0.61: 91.7,90.5 91.7,89.1 92.4,88.4 94.9,88.4 96.5,86.8 98.8,86.8 100.6,85 RN7.9
  Bottom 0.813: 96.3,101.1 96.3,100 91.7,95.4 91.7,90.5
8-1
  Top 0.305: RN8.5 103.46,88.98 105.3,87.14 105.3,81.34 102.4,78.44 102.4,73.84 101.7,73.14 SHIFT8.11
  Top 0.813: RN8.5 103.46,95.36 103.3,95.6 103.3,108.03 99.21,112.12 IN8.1
8-2
  Top 0.305: RN8.4 101.15,90.49 104.7,86.94 104.7,81.64 101.8,78.74 99.9,78.74 97.6,76.44 97.6,73.14 98.8,71.94 100.5,71.94 SHIFT8.12
  Top 0.813: RN8.4 100.92,95.32 102,96.4 102,107.3 97.6,111.7 97.6,116.45 IN8.2
8-3
  Top 0.305: RN8.3 98.38,89.86 99.8,88.44 102.4,88.44 104.1,86.74 104.1,81.94 101.5,79.34 99.7,79.34 97,76.64 97,72.84 99.2,70.64 100.53,70.64 SHIFT8.13
  Top 0.406: 100.5,119.3 100.5,116.77 IN8.3
  Top 0.813: RN8.3 98.38,94.68 100.8,97.1 100.8,106.6 96.3,111.1 96.3,117.8 98.3,119.7 100.1,119.7 100.5,119.3
8-4
  Top 0.305: RN8.2 98.49,87.84 102.2,87.84 103.5,86.54 103.5,82.14 101.3,79.94 99.5,79.94 96.4,76.84 96.4,72.54 99.6,69.33 SHIFT8.14
  Top 0.813: RN8.2 95.84,93.94 99.6,97.7 99.6,106.1 95,110.7 95,118.3 97.7,121 101.2,121 101.7,120.5 101.7,118.11 IN8.4
8-5
  Top 0.305: RN8.6 105.9,90.39 105.9,81.04 103,78.14 103,71.44 105.2,69.24 106.62,69.24 SHIFT8.3
  Bottom 0.813: RN8.6 106,94.4 104.2,96.2 104.2,115.43 IN8.5
8-6
  Top 0.305: RN8.7 108.54,89.18 106.5,87.14 106.5,80.84 103.6,77.94 103.6,72.24 105.13,70.7 SHIFT8.4
  Bottom 0.406: 105.5,114.3 105.5,116.85 IN8.6
  Bottom 0.813: RN8.7 108.54,93.76 105.6,96.7 105.6,114.2 105.5,114.3
8-7
  Top 0.305: RN8.8 111.08,90.12 108.5,87.54 108,87.54 107.1,86.64 107.1,80.64 104.2,77.74 104.2,72.84 105.2,71.84 106.68,71.84 SHIFT8.5
  Bottom 0.813: RN8.8 111.08,93.02 106.83,97.27 IN8.7
8-8
  Top 0.305: RN8.9 109.97,86.84 108.2,86.84 107.7,86.34 107.7,80.44 104.8,77.54 104.8,73.94 105.6,73.14 SHIFT8.6
  Bottom 0.406: 108.1,114.3 108.1,116.79 IN8.8
  Bottom 0.813: RN8.9 113.62,92.28 108.1,97.8 108.1,114.3
9-1
  Top 0.305: RN9.5 119.6,82.34 114.7,77.44 114.7,73.84 113.9,73.04 112.81,73.04 SHIFT9.11
  Top 0.813: RN9.5 119.6,87 119.7,87.1 119.7,93.88 IN9.1
9-2
  Top 0.305: RN9.4 117.06,81 113.9,77.84 110.9,77.84 109.7,76.64 109.7,73.34 111.2,71.84 112.67,71.84 SHIFT9.12
  Top 0.813: RN9.4 117.06,86.56 118.3,87.8 118.3,93.4 111.4,100.3 110.7,100.3 109.7,101.3 109.7,102.8 IN9.2
9-3
  Top 0.305: RN9.3 114.52,81.06 112.7,79.24 111.3,79.24 109.1,77.04 109.1,72.94 111.4,70.64 112.67,70.64 SHIFT9.13
  Top 0.406: 112.8,105.9 112.8,103.32 IN9.3
  Top 0.813: RN9.3 114.52,86.12 116.8,88.4 116.8,93 110.8,99 110.1,99 108.4,100.7 108.4,104.1 110.8,106.5 112.2,106.5 112.8,105.9
9-4
  Top 0.305: RN9.2 111.98,80.92 108.5,77.34 108.5,72.24 111.3,69.44 SHIFT9.14
  Top 0.813: RN9.2 111.98,85.58 115.4,89 115.4,92.4 110.1,97.7 109.4,97.7 107.1,100 107.1,104.7 110.4,108 112.9,108 114,106.9 114,104.66 IN9.4
9-5
  Top 0.305: RN9.6 122.14,81.98 119.6,79.44 117.5,79.44 115.3,77.24 115.3,71.84 117.8,69.34 SHIFT9.3
  Bottom 0.61: 116.6,87.7 116.6,86.9 117.7,85.7 120.9,85.7 122.1,84.6 122.1,83.68 RN9.6
  Bottom 0.813: IN9.5 116.59,93.49 116.6,92.1 116.6,87.7
9-6
  Top 0.305: RN9.7 124.68,81.22 124.2,80.74 121.7,80.74 119.8,78.84 117.7,78.84 115.9,77.04 115.9,72.54 117.8,70.64 118.82,70.64 SHIFT9.4
  Bottom 0.406: IN9.6 117.9,103.3 117.9,101.2
  Bottom 0.61: 117.9,88.2 117.9,87.3 118.7,86.6 121.8,86.6 122.8,85.6 123.8,85.6 124.7,84.7 124.7,83.66 RN9.7
  Bottom 0.813: 117.9,101.2 117.9,88.2
9-7
  Top 0.305: RN9.8 127.22,81.96 125.4,80.14 121.9,80.14 120,78.24 117.9,78.24 116.5,76.84 116.5,73.14 117.8,71.84 118.82,71.84 SHIFT9.5
  Bottom 0.61: 119.1,88.8 119.1,88.1 119.7,87.5 122.5,87.5 123.3,86.7 125.1,86.7 127.2,84.6 127.2,83.66 RN9.8
  Bottom 0.813: IN9.7 119.13,92.43 119.1,91.1 119.1,88.8
9-8
  Top 0.305: RN9.9 129.7,83.64 125.5,79.44 122.1,79.44 120.3,77.64 118.1,77.64 117.1,76.64 117.1,73.84 117.79,73.14 SHIFT9.6
  Bottom 0.406: IN9.8 120.4,103.34 120.4,101.2
  Bottom 0.61: 120.4,89.6 120.4,89.3 121.3,88.4 123.1,88.4 123.8,87.7 125.6,87.7 127.5,85.8 128.6,85.8 129.8,84.6 129.8,83.68 RN9.9
  Bottom 0.813: 120.4,101.2 120.4,89.6
10-1
  Top 0.305: RN10.5 132.51,89.13 134,87.64 134,82.74 131.4,80.14 129.4,80.14 126.7,77.44 126.7,73.84 126,73.14 SHIFT10.11
  Top 0.813: RN10.5 132.51,92.49 127.2,97.8 127.2,108.07 123.12,112.15 IN10.1
10-2
  Top 0.305: RN10.4 133.4,87.06 133.4,82.94 131.2,80.74 129.2,80.74 126.1,77.64 122.7,77.64 121.9,76.84 121.9,73.44 123.5,71.84 124.81,71.84 SHIFT10.12
  Top 0.813: RN10.4 129.97,92.93 126,96.9 126,107.4 121.3,112.1 121.3,115.87 IN10.2
10-3
  Top 0.305: RN10.3 129.38,88.54 131.1,88.54 132.8,86.84 132.8,83.14 131,81.34 129,81.34 125.9,78.24 122.5,78.24 121.3,77.04 121.3,72.94 123.6,70.64 124.81,70.64 SHIFT10.13
  Top 0.406: 124.4,118.9 124.4,116.41 IN10.3
  Top 0.813: RN10.3 127.43,93.47 124.8,96.1 124.8,106.8 120,111.6 120,117 122.7,119.7 123.6,119.7 124.4,118.9
10-4
  Top 0.305: RN10.2 127.44,87.94 130.7,87.94 132.2,86.44 132.2,83.34 130.8,81.94 128.8,81.94 125.7,78.84 122.3,78.84 120.7,77.24 120.7,72.64 124,69.33 SHIFT10.14
  Top 0.813: RN10.2 124.89,94.11 123.6,95.4 123.6,106.2 118.7,111.1 118.7,117.5 122.2,121 124.5,121 125.6,119.9 125.6,117.75 IN10.4
10-5
  Top 0.305: RN10.6 135.05,86.79 134.6,86.34 134.6,82.54 131.6,79.54 129.6,79.54 127.3,77.24 127.3,71.84 129.8,69.34 SHIFT10.3
  Bottom 0.813: RN10.6 135.05,91.55 128.2,98.4 IN10.5
10-6
  Top 0.305: RN10.7 137.59,88.53 135.2,86.14 135.2,82.34 131.8,78.94 129.8,78.94 127.9,77.04 127.9,72.34 129.7,70.54 130.93,70.54 SHIFT10.4
  Bottom 0.406: 129.5,113.9 129.5,116.39 IN10.6
  Bottom 0.813: RN10.7 137.59,91.11 129.5,99.2 129.5,113.9
10-7
  Top 0.305: RN10.8 140.13,90.17 135.8,85.84 135.8,82.14 132,78.34 130,78.34 128.5,76.84 128.5,73.14 129.8,71.84 130.96,71.84 SHIFT10.5
  Bottom 0.813: RN10.8 140.13,91.07 130.74,100.46 IN10.7
10-8
  Top 0.305: RN10.9 142.67,89.91 140.7,87.94 138.8,87.94 136.4,85.54 136.4,81.94 132.2,77.74 130.2,77.74 129.1,76.64 129.1,73.94 129.9,73.14 SHIFT10.6
  Bottom 0.406: 132,114 132,116.43 IN10.8
  Bottom 0.813: RN10.9 142.67,91.43 141,93.1 140.2,93.1 132,101.3 132,114
11-1
  Top 0.305: RN11.5 146.27,82.14 144.7,82.14 143.5,80.94 140.7,80.94 138.8,79.04 138.8,73.74 138.2,73.14 SHIFT11.11
  Top 0.813: RN11.5 148.1,84.04 148.1,93.7 142.1,99.6 138.74,99.6 IN11.1
11-2
  Top 0.305: RN11.4 143.13,81.54 140.4,81.54 137.2,78.34 135.2,78.34 134,77.14 134,73.24 135.36,71.88 SHIFT11.12
  Top 0.813: RN11.4 145.63,86.93 146.9,88.2 146.9,93.1 141.6,98.4 137.5,98.4 134.5,101.4 134.5,103.16 IN11.2
11-3
  Top 0.305: RN11.3 141.19,82.14 140.2,82.14 137,78.94 135,78.94 133.4,77.34 133.4,72.84 135.63,70.61 SHIFT11.13
  Top 0.406: 137.4,106.1 137.4,103.58 IN11.3
  Top 0.813: RN11.3 143.09,86.09 145.7,88.7 145.7,92.4 140.9,97.2 136.8,97.2 133.2,100.8 133.2,104.7 135,106.5 137,106.5 137.4,106.1
11-4
  Top 0.305: RN11.2 140.55,83.29 136.8,79.54 134.8,79.54 132.8,77.54 132.8,72.44 135.9,69.34 SHIFT11.14
  Top 0.813: RN11.2 140.55,85.25 144.5,89.2 144.5,91.8 140.3,96 136.2,96 131.9,100.3 131.9,105.3 134.6,108 137.9,108 138.8,107.1 138.8,104.92 IN11.4
11-5
  Top 0.305: RN11.6 148.81,82.14 147.4,82.14 146.8,81.54 145,81.54 143.8,80.34 140.9,80.34 139.4,78.84 139.4,70.44 140.5,69.33 SHIFT11.3
  Bottom 0.61: 144.5,89.1 144.5,88.4 146.9,86 149.7,86 150.8,84.9 150.8,84.13 RN11.6
  Bottom 0.813: IN11.5 141.24,95.36 144.5,92.1 144.5,89.1
11-6
  Top 0.305: RN11.7 151.45,82.24 150.1,82.24 149.4,81.54 147.7,81.54 147.1,80.94 145.3,80.94 144.1,79.74 141.1,79.74 140,78.64 140,71.54 140.94,70.61 SHIFT11.4
  Bottom 0.406: IN11.6 142.5,103.56 142.5,101.2
  Bottom 0.61: 145.7,89.1 145.7,88.6 147.4,86.9 152.2,86.9 153.3,85.8 153.3,84.09 RN11.7
  Bottom 0.813: 142.5,101.2 142.5,95.9 145.7,92.7 145.7,89.1
11-7
  Top 0.305: SHIFT11.5 141.16,71.88 140.6,72.44 140.6,78.44 141.3,79.14 144.3,79.14 145.5,80.34 147.3,80.34 147.9,80.94 149.6,80.94 150.3,81.64 152,81.64 152.6,82.24 154.2,82.24 155.6,83.64 RN11.8
  Bottom 0.61: 146.9,89.2 146.9,88.8 147.9,87.8 153.8,87.8 155.8,85.8 RN11.8
  Bottom 0.813: IN11.7 143.78,96.42 146.9,93.3 146.9,89.2
11-8
  Top 0.305: RN11.9 155.93,81.64 152.9,81.64 152.3,81.04 150.5,81.04 149.8,80.34 148.1,80.34 147.5,79.74 145.7,79.74 143.9,77.94 141.6,77.94 141.2,77.54 141.2,73.74 141.79,73.14 SHIFT11.6
  Bottom 0.406: IN11.8 145.1,103.5 145.1,101.2
  Bottom 0.61: 148.1,89.3 148.7,88.7 154.7,88.7 158.2,85.2 158.2,84.17 RN11.9
  Bottom 0.813: 145.1,101.2 145.1,96.9 148.1,93.9 148.1,89.3
12-1
  Top 0.305: SHIFT12.11 151.31,73.14 152.1,73.94 152.1,77.44 153.9,79.24 159.34,79.24 159.8,79.7
  Top 0.406: RN12.5 160.16,90.14 161.7,88.6 162.9,88.6 164.5,87 164.5,84.4 159.8,79.7
  Top 0.813: RN12.5 160.16,92.64 151.8,101 151.8,108.03 147.27,112.56 IN12.1
12-2
  Top 0.305: SHIFT12.12 150.19,71.84 149,71.84 147.3,73.54 147.3,77.04 148.8,78.54 152.4,78.54 153.7,79.84 158.94,79.84 159.4,80.3
  Top 0.406: RN12.4 157.62,90.58 159.5,88.7 160.5,88.7 161.4,87.8 162.4,87.8 163.5,86.7 163.5,84.4 159.4,80.3
  Top 0.813: RN12.4 157.62,93.28 150.6,100.3 150.6,107.4 145.6,112.4 145.6,115.93 IN12.2
12-3
  Top 0.305: SHIFT12.13 150.19,70.64 149.2,70.64 146.7,73.14 146.7,77.24 148.6,79.14 152.2,79.14 153.5,80.44 158.54,80.44 158.9,80.8
  Top 0.406: 148.5,118.8 148.5,116.37 IN12.3 | RN12.3 157.02,88.7 158.3,88.7 159.1,87.9 160.1,87.9 161.1,86.9 162.1,86.9 162.6,86.4 162.6,84.5 158.9,80.8
  Top 0.61: 155.1,90.62 RN12.3
  Top 0.813: RN12.3 155.08,93.92 149.4,99.6 149.4,106.8 144.4,111.9 144.4,117.2 146.6,119.4 147.9,119.4 148.5,118.8
12-4
  Top 0.305: SHIFT12.14 150.13,69.24 149.5,69.24 146.1,72.64 146.1,77.44 148.4,79.74 151.9,79.74 153.2,81.04 158.04,81.04 158.4,81.4
  Top 0.406: RN12.2 154.58,88.6 155.8,88.6 156.5,87.9 157.9,87.9 158.7,87.1 159.7,87.1 160.7,86.1 161.7,86.1 161.8,86 161.8,84.8 158.4,81.4
  Top 0.61: 152.5,90.6 RN12.2
  Top 0.813: RN12.2 152.64,94.56 148.2,99 148.2,106.3 143.2,111.3 143.2,118.2 145.9,120.9 149.1,120.9 149.9,120.1 149.9,117.69 IN12.4
12-5
  Top 0.305: SHIFT12.3 156.28,69.24 153.4,69.24 152.7,69.94 152.7,77.24 154.2,78.64 159.74,78.64 160.1,79
  Top 0.406: RN12.6 162.7,90.4 165.6,87.5 165.6,84.5 160.1,79
  Bottom 0.813: RN12.6 162.7,92.6 161.9,93.4 155.9,93.4 152.3,97 152.3,115.01 IN12.5
12-6
  Top 0.305: SHIFT12.4 156.34,70.64 154,70.64 153.3,71.34 153.3,76.94 154.4,78.04 160.14,78.04 160.5,78.4
  Top 0.406: RN12.7 165.24,90.16 166.6,88.8 166.6,84.5 160.5,78.4
  Bottom 0.406: IN12.6 153.6,116.35 153.6,113.9
  Bottom 0.813: RN12.7 165.24,92.26 162.8,94.7 156.5,94.7 153.5,97.7 153.5,113.8 153.6,113.9
12-7
  Top 0.305: SHIFT12.5 156.34,71.84 154.5,71.84 153.9,72.44 153.9,76.64 154.7,77.44 160.54,77.44 160.9,77.8
  Top 0.406: RN12.8 167.78,85 167.78,84.68 160.9,77.8
  Top 0.61: 168,90.42 RN12.8
  Bottom 0.813: RN12.8 167.78,91.82 163.5,96.1 157,96.1 154.8,98.3 154.8,114.97 IN12.7
12-8
  Top 0.305: SHIFT12.6 155,73.14 154.5,73.64 154.5,76.34 155,76.84 160.94,76.84 161.4,77.3 | 168.72,84.62 168.72,88.02 170.4,89.7 170.4,90.56 RN12.9
  Top 0.406: 161.4,77.3 168.72,84.62
  Top 0.61: 170.3,90.62 RN12.9
  Bottom 0.406: IN12.8 156.2,116.29 156.2,113.8
  Bottom 0.813: RN12.9 170.32,91.38 164.2,97.5 157.6,97.5 156.2,98.9 156.2,113.8
13-1  (via drill 0.6)
  Top 0.305: v164.6,78.94 164.6,74.14 163.6,73.14 SHIFT13.11
  Top 0.813: RN13.5 174.88,77.38 180.3,82.8 180.3,96.1 175.9,100.5 175.9,107.5 172.4,111 161,111 157.9,107.9 157.9,104.04 IN13.1
  Bottom 0.305: RN13.5 173.56,76.74 166,76.74 164.6,78.14 v164.6,78.94
13-2  (via drill 0.6)
  Top 0.305: v165.9,78.94 165.9,77.84 165.2,77.14 165.2,73.24 163.8,71.84 162.4,71.84 SHIFT13.12
  Top 0.813: RN13.4 175.02,79.92 179,83.9 179,95.2 174.4,99.8 174.4,107 171.7,109.7 161.7,109.7 159.4,107.4 159.4,105.08 IN13.2
  Bottom 0.305: RN13.4 174.08,79.92 171.5,77.34 166.4,77.34 165.9,77.84 v165.9,78.94
13-3  (via drill 0.6)
  Top 0.305: v167.2,78.94 167.2,78.34 165.8,76.94 165.8,72.84 163.6,70.64 162.4,70.64 SHIFT13.13
  Top 0.406: 160.8,106.3 160.8,103.68 IN13.3
  Top 0.813: RN13.3 174.96,82.46 177.7,85.2 177.7,94.3 173,99 173,106.3 170.9,108.4 162.4,108.4 160.8,106.8 160.8,106.3
  Bottom 0.305: RN13.3 174.2,82.44 169.7,77.94 167.9,77.94 167.2,78.64 v167.2,78.94
13-4  (via drill 0.6)
  Top 0.305: v168.5,78.94 168.5,78.84 166.4,76.74 166.4,72.04 163.7,69.34 SHIFT13.14
  Top 0.813: RN13.2 175.1,85 176.5,86.4 176.5,93.5 171.6,98.4 171.6,105.7 170.2,107.1 163.5,107.1 162.08,105.68 IN13.4
  Bottom 0.305: RN13.2 168.5,79.3 v168.5,78.94
13-5  (via drill 0.6)
  Top 0.305: SHIFT13.3 169.7,69.33 170.2,68.84 170.2,66.44 168.8,65.04 v168.8,64.84
  Bottom 0.305: RN13.6 172.3,72.94 172.3,71.74 168.8,68.24 v168.8,64.84
  Bottom 0.813: RN13.6 175.34,74.84 176.4,75.9 176.4,89.7 167.2,98.9 166.5,98.9 164.6,100.8 164.6,102.38 IN13.5
13-6  (via drill 0.6)
  Top 0.305: v170.1,64.84 170.1,65.54 170.8,66.24 170.8,70.14 170.3,70.64 168.55,70.64 SHIFT13.4
  Bottom 0.305: RN13.7 170.1,68.2 v170.1,64.84
  Bottom 0.406: 168.4,99.3 167.2,100.5 166.6,100.5 165.9,101.2 165.9,103.66 IN13.6
  Bottom 0.813: RN13.7 174.6,72.3 177.6,75.3 177.6,90.2 168.4,99.3
13-7  (via drill 0.6)
  Top 0.305: v171.4,64.84 171.4,70.94 170.4,71.94 168.58,71.94 SHIFT13.5
  Bottom 0.305: RN13.8 171.4,66.96 v171.4,64.84
  Bottom 0.406: 167.16,102.04 IN13.7 167.16,101.54 167.6,101.1 168,101.1 169.6,99.7
  Bottom 0.813: RN13.8 178.8,74.36 178.8,90.7 169.6,99.7
13-8  (via drill 0.6)
  Top 0.305: v172.7,64.84 172.3,65.24 172.3,70.94 170.09,73.14 SHIFT13.6
  Bottom 0.305: RN13.9 172.7,65.72 v172.7,64.84 | IN13.8 168.43,103.67
  Bottom 0.406: 170.8,100.2 170,101 169.2,101 168.4,101.8 168.4,102 168.43,102.03 168.43,103.67
  Bottom 0.813: RN13.9 180.1,73.12 180.1,91.1 170.8,100.2
+3V3  (via drill 0.6)
  Top 0.61: IC1.P$57 IC1.P$56 IC1.P$55
  Top 0.813: v45.5,10.45 v50.15,10.45 | U$4.CHPD 62.63,12.01 61.07,10.45 56.23,10.45 55.42,9.64
  Top 1.27: IC1.P$56 42.22,52.48 43.29,53.55 v49.7,53.55
  Top 1.676: v51.5,23.34 56.8,18.04 56.8,11.14 55.35,9.69 | 55.35,9.69 55.22,9.56 U$2.VOUT | 55.42,9.64 55.37,9.69 55.35,9.69
  Bottom 0.61: 45.3,10.45 v45.5,10.45 | v50.15,10.45 52.27,10.45 R20-1K.2
  Bottom 0.813: R26-1K.2 43.82,8.77 v45.5,10.45 | U$4.VCC 66.3,10.94 63.7,10.94 62.63,12.01 U$4.CHPD
  Bottom 1: C7-100U.+ 46.92,40.14
  Bottom 1.27: C8-100U.+ 47.17,47.62 50.4,50.85 50.4,52.85 v49.7,53.55 | v50.15,10.45 54.19,10.45 55.22,9.42 U$2.VOUT
  Bottom 1.676: C8-100U.+ 46.57,47.48 C7-100U.+ 46.57,31.97 51.5,27.04 51.5,26.7 | 51.5,26.7 v51.5,23.34 | 51.6,26.7 51.5,26.7
+9V
  Top 1.676: U$1.VIN 151.8,40.5 175.2,40.5 177.82,37.88 CN1.PWR
A-1
  Top 0.61: SHIFTOUTA.15 21.84,131.24 24.4,133.8 24.4,137.1 27.5,140.2 27.5,154.7 30.6,157.8 30.6,162.13 OUTA.1
A-2
  Top 0.61: SHIFTOUTA.1 23.11,137.21 26.5,140.6 26.5,155.3 29.2,158 29.2,160.99 OUTA.2
A-3
  Top 0.406: 27.9,160 27.9,162.29 OUTA.3
  Top 0.61: SHIFTOUTA.2 21.84,137.34 25.5,141 25.5,155.8 27.9,158.2 27.9,160
A-4
  Top 0.61: SHIFTOUTA.3 20.57,137.47 24.5,141.4 24.5,156.3 26.7,158.5 26.7,160.95 OUTA.4
A-5
  Top 0.406: 25.4,160 25.4,162.25 OUTA.5
  Top 0.61: SHIFTOUTA.4 19.3,137.59 23.5,141.8 23.5,156.8 25.4,158.7 25.4,160
A-6
  Top 0.61: SHIFTOUTA.5 18.03,137.72 22.5,142.2 22.5,157.3 24.1,158.9 OUTA.6
A-7
  Top 0.406: 22.8,160 22.8,162.31 OUTA.7
  Top 0.61: SHIFTOUTA.6 16.76,137.85 21.5,142.6 21.5,157.8 22.8,159.1 22.8,160
A-8
  Top 0.61: SHIFTOUTA.7 15.48,137.99 20.5,143 20.5,158.3 21.5,159.3 21.5,160.97 OUTA.8
B-1
  Top 0.406: 41,146.4 41,148.62 OUTB.1
  Top 0.61: SHIFTOUTB.15 33.88,131.28 36.4,133.8 36.4,137.2 39.1,139.9 39.1,142.9 41,144.8 41,146.4
B-2
  Top 0.61: SHIFTOUTB.1 35.16,137.25 38.1,140.2 38.1,143.3 39.69,144.89 OUTB.2
B-3
  Top 0.406: 38.4,146.4 38.4,148.68 OUTB.3
  Top 0.61: SHIFTOUTB.2 33.88,137.28 37.1,140.5 37.1,143.7 38.4,145 38.4,146.4
B-4
  Top 0.61: SHIFTOUTB.3 32.62,137.31 36.1,140.8 36.1,144.1 37.15,145.15 OUTB.4
B-5
  Top 0.406: 35.9,146.3 35.9,148.64 OUTB.5
  Top 0.61: SHIFTOUTB.4 31.35,137.34 35.1,141.1 35.1,144.5 35.9,145.3 35.9,146.3
B-6
  Top 0.61: SHIFTOUTB.5 30.08,137.38 34.1,141.4 34.1,145 34.61,145.51 OUTB.6
B-7
  Top 0.406: 33.37,146.27 33.37,148.63 OUTB.7
  Top 0.61: SHIFTOUTB.6 28.8,137.41 33.1,141.7 33.1,145.6 33.37,145.87 33.37,146.27
B-8
  Top 0.61: SHIFTOUTB.7 27.54,137.44 32.07,141.97 OUTB.8
C-1
  Top 0.406: 53.19,159.93 53.2,162.28 OUTC.1
  Top 0.61: SHIFTOUTC.15 45.94,131.84 48.5,134.4 48.5,136.6 51.3,139.4 51.3,155.5 53.19,157.33 53.19,159.93
C-2
  Top 0.61: SHIFTOUTC.1 47.2,136.81 50.3,139.9 50.3,156.1 51.93,157.7 OUTC.2
C-3
  Top 0.406: 50.7,159.98 50.7,162.24 OUTC.3
  Top 0.61: SHIFTOUTC.2 45.94,137.03 49.3,140.4 49.3,156.7 50.7,158.08 50.7,159.98
C-4
  Top 0.61: SHIFTOUTC.3 44.66,137.26 48.3,140.9 48.3,157.2 49.39,158.29 OUTC.4
C-5
  Top 0.406: 48.12,160.03 48.12,162.3 OUTC.5
  Top 0.61: SHIFTOUTC.4 43.4,137.5 47.3,141.4 47.3,157.8 48.12,158.62 48.12,160.03
C-6
  Top 0.61: SHIFTOUTC.5 42.12,137.72 46.3,141.9 46.3,158.4 46.85,158.95 OUTC.6
C-7
  Top 0.406: 45.6,160 45.6,162.26 OUTC.7
  Top 0.61: SHIFTOUTC.6 40.86,137.85 45.3,142.3 45.3,159 45.6,159.3 45.6,160
C-8
  Top 0.61: SHIFTOUTC.7 39.59,137.99 44.31,142.71 OUTC.8
CE  (via drill 0.6)
  Top 0.61: SHIFT1.15 16.74,68.06 17.5,67.3 17.5,66.3 18.2,65.6 24.2,65.6 26.67,68.06 SHIFT2.15 29.09,68.06 29.84,67.32 29.84,66.26 30.5,65.6 36.7,65.6 37.7,66.6 37.7,67.5 38.3,68.1 39.83,68.1 SHIFT3.15 41.44,68.06 42.3,67.2 42.3,66.2 42.9,65.6 48.9,65.6 49.7,66.4 49.7,67.2 50.6,68.1 51.97,68.1 SHIFT4.15 53.54,68.06 54.2,67.4 54.2,66.3 54.9,65.6 61.6,65.6 62,66 62,67 63.1,68.1 64.11,68.1 SHIFT5.15 65.63,68.06 66.5,67.2 66.5,66.7 67.6,65.6 73.6,65.6 74.1,66.1 74.1,67.4 74.7,68 76.22,68 SHIFT6.15 77.73,68.06 78.4,67.4 78.4,66.7 79.4,65.7 85.7,65.7 86.1,66.1 86.1,67.3 86.9,68.1 88.39,68.1 SHIFT7.15 89.83,68.06 90.9,67 90.9,66.3 91.6,65.6 97.5,65.6 98.4,66.5 98.4,67.3 99.1,68 100.5,68 SHIFT8.15 102.33,68.06 103.1,67.3 103.1,66.5 104,65.6 110.1,65.6 110.5,66 110.5,66.9 111.6,68 112.64,68 SHIFT9.15 114.43,68.06 115.3,67.2 115.3,66.3 115.9,65.7 122.3,65.7 122.9,66.3 122.9,67.5 123.4,68 124.78,68 SHIFT10.15 126.53,68.06 127.3,67.3 127.3,66.5 128.1,65.7 134.3,65.7 134.7,66.1 134.7,67.6 135.2,68.1 136.95,68.1 SHIFT11.15 138.53,68.06 139.2,67.4 139.2,66.5 140.1,65.6 146.9,65.6 147.7,66.4 147.7,67 148.8,68.1 150.19,68.1 SHIFT12.15 151.53,68.06 152.5,67.1 152.5,66.2 153.1,65.6 159.7,65.6 160.1,66 160.1,67.4 160.8,68.1 162.33,68.1 SHIFT13.15
  Top 0.813: 91.6,65.6 91.6,65 v92.2,64.4
  Bottom 1.016: v92.2,64.4 92.2,62.6
  Bottom 1.27: U3.7 77.12,57.17 78.52,58.57 88.17,58.57 92.2,62.6
CLK  (via drill 0.6)
  Top 0.61: v23.5,68.1 21.77,68.1 SHIFT1.2 19.46,68.06 v19.1,67.7 | v36.6,68.1 36.57,68.06 SHIFT2.2 | SHIFT3.2 46.08,68 v48.8,68 | SHIFT4.2 58.22,68 v61.2,68 | SHIFT5.2 70.36,68 v73.1,68 | SHIFT6.2 82.5,68 v85.2,68 | SHIFT7.2 94.64,68 v97.4,68 | SHIFT8.2 106.78,68 v109.8,68 | SHIFT9.2 118.92,68 v121.8,68 | SHIFT10.2 131.06,68 v133.6,68 | SHIFT11.2 arc90 143.2,68 v146.6,68 | SHIFT12.2 arc90 156.44,68 v159,68 | SHIFT13.2 arc-90 168.45,68 v164.6,68
  Top 1.27: v19.12,59.21 77.49,59.21 79.66,57.04 U3.6
  Bottom 0.61: v23.5,68.1 v36.6,68.1 36,68.1 v48.8,68 v61.2,68 v73.1,68 v85.2,68 v97.4,68 v109.8,68 v121.8,68 v133.6,68 v146.6,68 v159,68 v164.6,68
  Bottom 1.016: v19.1,67.7 v19.12,59.21
D-1
  Top 0.406: 64.7,146.6 64.7,148.8 OUTD.1
  Top 0.61: SHIFTOUTD.15 57.98,131.88 60.4,134.3 60.4,136.3 62.8,138.7 62.8,143.4 64.7,145.3 64.7,146.6
D-2
  Top 0.61: SHIFTOUTD.1 59.26,136.66 61.8,139.2 61.8,143.9 63.4,145.5 63.4,147.52 OUTD.2
D-3
  Top 0.406: 62.2,146.6 62.2,148.76 OUTD.3
  Top 0.61: SHIFTOUTD.2 57.98,136.88 60.8,139.7 60.8,144.5 62.2,145.9 62.2,146.6
D-4
  Top 0.61: SHIFTOUTD.3 56.72,137.12 59.8,140.2 59.8,144.9 60.9,146 60.9,147.52 OUTD.4
D-5
  Top 0.406: 59.6,146.5 59.6,148.82 OUTD.5
  Top 0.61: SHIFTOUTD.4 55.45,137.34 58.8,140.7 58.8,145.3 59.6,146.1 59.6,146.5
D-6
  Top 0.61: SHIFTOUTD.5 54.18,137.57 57.8,141.2 57.8,145.8 58.3,146.3 58.3,147.5 OUTD.6
D-7
  Top 0.406: 57.1,146.5 57.1,148.78 OUTD.7
  Top 0.61: SHIFTOUTD.6 52.91,137.81 56.8,141.7 56.8,146.2 57.1,146.5
D-8
  Top 0.61: SHIFTOUTD.7 51.63,138.03 55.8,142.2 OUTD.8
DS_OE  (via drill 0.6)  (3 unrouted)
  Top 0.406: v151.8,124.7 151.8,129.5 SHIFTOUTL.13 | v163.9,124.7 163.9,129.5 SHIFTOUTM.13 | v139.8,124.6 139.8,129.5 SHIFTOUTK.13 | v127.7,124.7 127.7,129.5 SHIFTOUTJ.13 | v115.7,124.6 115.7,129.5 SHIFTOUTI.13 | v103.6,124.7 103.6,129.5 SHIFTOUTH.13 | v91.6,124.8 91.6,129.5 SHIFTOUTG.13 | v79.5,124.7 79.5,129.5 SHIFTOUTF.13 | v67.5,124.8 67.5,129.5 SHIFTOUTE.13 | v55.4,124.7 55.4,129.5 SHIFTOUTD.13 | v43.3,124.7 43.4,129.5 SHIFTOUTC.13 | v31.3,124.8 31.3,129.4 SHIFTOUTB.13 | v19.3,125.3 19.3,129.4 SHIFTOUTA.13
  Top 1.016: v163.9,124.7 163.9,123.8 166.5,121.2 169.2,121.2 180.9,109.5 180.9,102 184.8,98.1 184.8,54.5 177,46.7 159.4,46.7 150.21,55.89 123.99,55.89 121.4,53.3 121.4,50.6 124.1,47.9 125.34,47.9 U3.24
  Bottom 0.406: v163.9,124.7 162.1,124.7 161.8,125 160.5,125 160.2,125.3 159,125.3 158.7,125.6 152.7,125.6 152.2,125.1 v151.8,124.7 150,124.7 149.7,125 148.4,125 148.1,125.3 146.6,125.3 146.3,125.6 140.8,125.6 139.9,124.7 | 139.9,124.7 137.9,124.7 137.6,125 136.2,125 135.9,125.3 134.6,125.3 134.3,125.6 128.6,125.6 v127.7,124.7 125.8,124.7 125.5,125 124.2,125 123.9,125.3 122.5,125.3 122.2,125.6 116.6,125.5 115.8,124.7 | 139.9,124.7 v139.8,124.6 | 115.8,124.7 113.8,124.7 113.5,125 112.1,125 111.8,125.3 110.1,125.3 109.8,125.6 104.5,125.6 v103.6,124.7 101.9,124.7 101.6,125 100.2,125 99.9,125.3 98.3,125.3 98,125.6 92.4,125.6 91.5,124.7 89.8,124.7 89.5,125 88.2,125 87.9,125.3 86.5,125.3 86.2,125.6 80.4,125.6 v79.5,124.7 77.8,124.7 77.5,125 76.2,125 75.9,125.3 74.6,125.3 74.3,125.6 68.3,125.6 67.4,124.7 65.6,124.7 65.3,125 64.1,125 63.8,125.3 62.6,125.3 62.3,125.6 56.3,125.6 v55.4,124.7 51,124.7 50.1,125.6 44.2,125.6 v43.3,124.7 41.4,124.7 41.1,125 39.9,125 39.6,125.3 38.2,125.3 37.9,125.6 32.1,125.6 31.2,124.7 29.4,124.7 29.1,125 27.9,125 27.6,125.3 26.3,125.3 26,125.6 19.6,125.6 v19.3,125.3 | 115.8,124.7 v115.7,124.6
E-1
  Top 0.406: 76.3,160 76.3,162.1 OUTE.1
  Top 0.61: SHIFTOUTE.15 70.03,131.74 72.5,134.2 72.5,136.6 74.3,138.4 74.3,156.1 76.3,158.1 76.3,160
E-2
  Top 0.61: OUTE.2 74.91,158.11 73.3,156.5 73.3,138.9 71.3,136.91 SHIFTOUTE.1
E-3
  Top 0.406: 73.6,159.9 73.6,162.26 OUTE.3
  Top 0.61: 73.6,159.9 73.6,158.2 72.3,156.9 72.3,139.5 70.03,137.24 SHIFTOUTE.2
E-4
  Top 0.61: OUTE.4 72.37,158.47 71.3,157.4 71.3,140 68.77,137.47 SHIFTOUTE.3
E-5
  Top 0.406: 71.1,160 71.1,162.22 OUTE.5
  Top 0.61: 71.1,160 71.1,158.8 70.3,158 70.3,140.5 67.49,137.69 SHIFTOUTE.4
E-6
  Top 0.61: OUTE.6 69.83,159.03 69.3,158.5 69.3,140.9 66.22,137.93 SHIFTOUTE.5
E-7
  Top 0.406: 68.6,159.9 68.6,162.18 OUTE.7
  Top 0.61: 68.6,159.9 68.6,159.4 68.3,159.1 68.3,141.3 64.95,137.96 SHIFTOUTE.6
E-8
  Top 0.61: OUTE.8 67.29,141.69 63.69,138.09 SHIFTOUTE.7
ESP_RX
  Bottom 0.61: R1-1K1.1 73.25,17.06 R5-2K1.2 68.07,14.54 U$4.RXD
ESP_TX  (via drill 0.6)
  Top 0.813: v77,19.4 77,22 87.28,32.28 U3.3
  Bottom 0.813: U$4.TXD 60.09,11.75 62.4,9.44 73.44,9.44 77,13 v77,19.4
F-1
  Top 0.406: 87.6,146.5 87.6,148.42 OUTF.1
  Top 0.61: SHIFTOUTF.15 82.08,131.78 84.5,134.2 84.5,136.6 86.8,138.9 86.8,144.7 87.6,145.5 87.6,146.5
F-2
  Top 0.61: SHIFTOUTF.1 83.35,136.85 85.8,139.3 85.8,145.2 86.14,145.54 OUTF.2
F-3
  Top 0.406: 84.9,146.3 84.9,148.58 OUTF.3
  Top 0.61: SHIFTOUTF.2 82.08,137.09 84.7,139.7 84.7,145.5 84.9,145.7 84.9,146.3
F-4
  Top 0.61: SHIFTOUTF.3 80.81,137.31 83.6,140.1 OUTF.4
F-5
  Top 0.406: 82.3,146.3 82.3,148.64 OUTF.5
  Top 0.61: SHIFTOUTF.4 79.54,137.44 82.3,140.2 82.3,146.3
F-6
  Top 0.61: SHIFTOUTF.5 78.27,137.47 81.1,140.3 81.1,147.3 OUTF.6
F-7
  Top 0.406: 79.8,146.3 79.8,148.6 OUTF.7
  Top 0.61: SHIFTOUTF.6 77,137.5 79.8,140.3 79.8,146.3
F-8
  Top 0.61: SHIFTOUTF.7 75.73,137.63 78.5,140.4 78.5,143.2 78.52,145.28 OUTF.8
G-1
  Top 0.61: SHIFTOUTG.15 94.13,131.94 96.6,134.4 96.6,137.1 97.5,138 97.5,156.9 99.6,159 99.6,161.93 OUTG.1
G-2
  Top 0.61: SHIFTOUTG.1 95.41,136.91 95.4,136.9 95.4,137.4 96.5,138.5 96.5,157.3 98.1,158.9 OUTG.2
G-3
  Top 0.406: 96.8,159.9 96.8,162.19 OUTG.3
  Top 0.61: SHIFTOUTG.2 94.13,137.53 95.5,138.9 95.5,158 96.8,159.3 96.8,159.9
G-4
  Top 0.61: SHIFTOUTG.3 92.86,137.66 94.5,139.3 94.5,158.5 95.56,159.56 OUTG.4
G-5
  Top 0.406: 94.3,159.8 94.3,162.15 OUTG.5
  Top 0.61: SHIFTOUTG.4 91.59,137.79 93.5,139.7 93.5,158.9 94.3,159.7 94.3,159.8
G-6
  Top 0.61: SHIFTOUTG.5 90.32,137.93 92.5,140.1 92.5,159.3 93,159.8 93,160.87 OUTG.6
G-7
  Top 0.406: 91.8,159.8 91.8,162.11 OUTG.7
  Top 0.61: SHIFTOUTG.6 89.05,138.06 91.5,140.5 91.5,159.5 91.8,159.8
G-8
  Top 0.61: SHIFTOUTG.7 87.78,138.19 90.48,140.88 OUTG.8
GND  (via drill 0.5, 0.6)  (2 unrouted)
  Top 0.61: IC1.P$65 IC1.P$64 IC1.P$63 IC1.P$62 IC1.P$61 | R5-2K.1 15.06,35.49 S1.3 | IC1.P$17 24.55,29.11 | 24.55,29.11 T9.E | IC1.P$18 28.33,25.98 v27.6,25.25 | v25.6,28.25 24.74,29.11 24.55,29.11 | SHIFT1.8 20.52,76.9 v20.5,76.9 | v33.1,77.3 33.78,76.62 SHIFT2.8 | SHIFT3.8 v46,77.2 | v58.2,77.3 58.15,77.25 SHIFT4.8 | SHIFT5.8 70.1,75.88 v70.1,77.3 | v82.4,77.4 82.43,77.37 SHIFT6.8 | SHIFT7.8 94.5,75.76 v94.5,77.4 | SHIFT8.8 106.71,77.39 v106.7,77.4 | SHIFT9.8 118.85,76.55 v118.9,76.7 | SHIFT10.8 v131,76.74 | SHIFT11.8 143,75.82 v143,76.7 | SHIFT12.8 156.39,75.7 v158.5,75.7 | v170.6,75.6 170.51,75.69 SHIFT13.8 | v158.4,137.9 158.81,137.49 SHIFTOUTM.8 158.8,135.5 v158.8,133.6 | v14.2,133.6 SHIFTOUTA.8 | v26.3,133.6 26.3,135.6 SHIFTOUTB.8 | v38.4,133.6 SHIFTOUTC.8 | v50.4,133.6 50.4,135.7 SHIFTOUTD.8 | v62.4,133.6 62.4,135.7 SHIFTOUTE.8 | v74.4,133.6 74.5,135.7 SHIFTOUTF.8 | v86.5,133.6 SHIFTOUTG.8 | v98.6,133.6 98.6,135.7 SHIFTOUTH.8 | v110.6,133.7 SHIFTOUTI.8 | v122.7,133.6 122.7,135.7 SHIFTOUTJ.8 | v134.7,133.6 134.7,135.7 SHIFTOUTK.8 | v146.8,133.6 146.8,135.7 SHIFTOUTL.8
  Top 0.813: C9-100N14.1 23.4,123.8 v23.7,123.5 23.7,121.1 v23,120.4 | C9-100N15.1 35.7,123.06 v35.7,120.43 | C9-100N16.1 v44.06,120.45 | C9-100N17.1 63.15,124.15 66.62,120.68 v67,120.68 | C9-100N18.1 75.23,124.08 76.89,122.42 78.34,122.42 v80.26,120.5 | C9-100N19.1 86.53,124 v90.08,120.45 | C9-100N20.1 99.4,124.03 100.76,122.67 102.14,122.67 v104.17,120.64 | C9-100N21.1 111.14,124.05 v114.74,120.45 | C9-100N22.1 121.23,123.68 121.37,123.54 125.11,123.54 v128.29,120.36 | C9-100N23.1 134.86,124.08 v138.49,120.45 | C9-100N24.1 148.31,124.07 151.97,120.41 156.1,120.41 v156.19,120.5 153.84,122.85 C9-100N25.1 | C9-100N26.1 171.4,126.37 v171.55,126.22
  Top 1.016: v71.2,12.4 71.2,15.8 69.6,17.4 61.2,17.4 60.1,16.3 U$4.GND | U$4.GND 60.1,18.1 58.5,19.7 58.5,20.5 55.2,23.8 55.2,25.5
  Top 1.27: v164.6,112.9 160.1,112.9 154.9,107.7 154.9,101.9 161.4,95.4 170.1,95.4 173.7,91.8 173.7,90.4 170.6,87.3 v170.6,75.6
  Bottom 0.406: CSIM_100N.1 27.58,11.07 28.99,12.49 D15.2